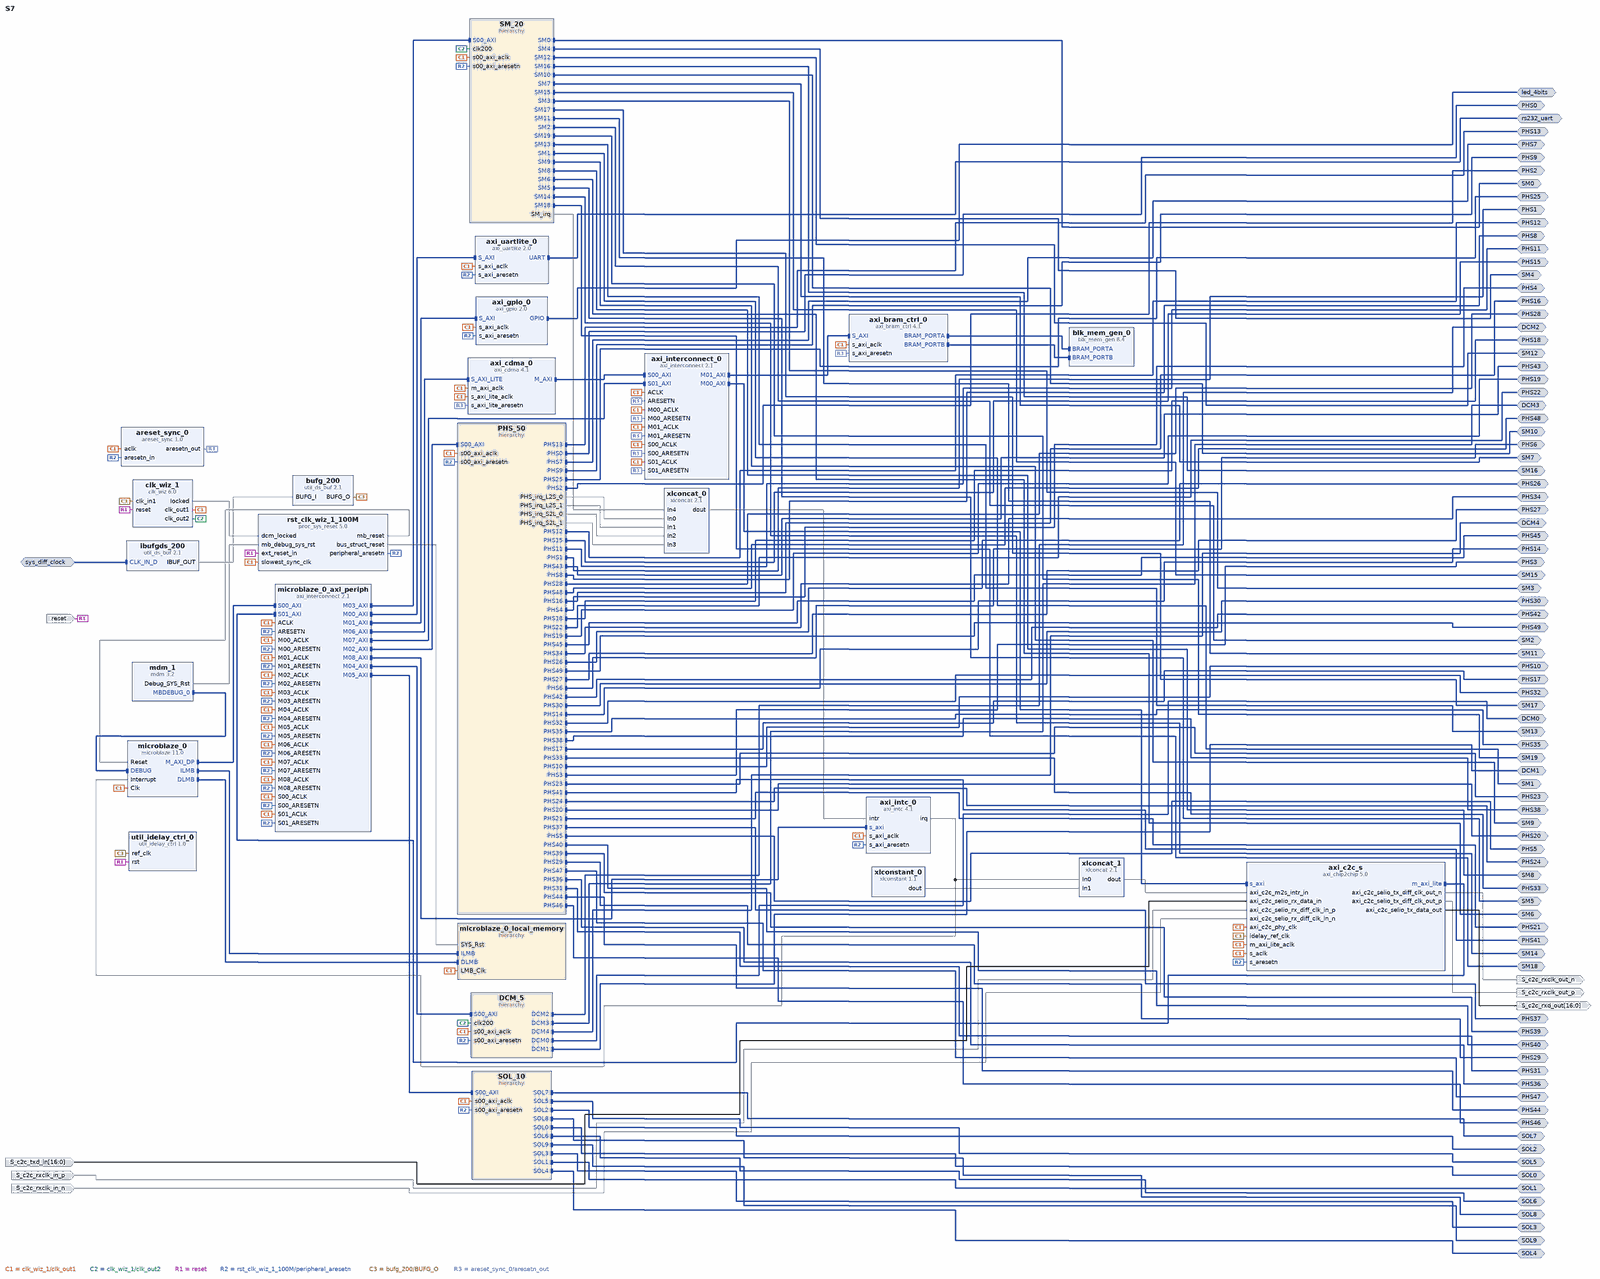
[diagram p0: block diagram of the top level, whole]
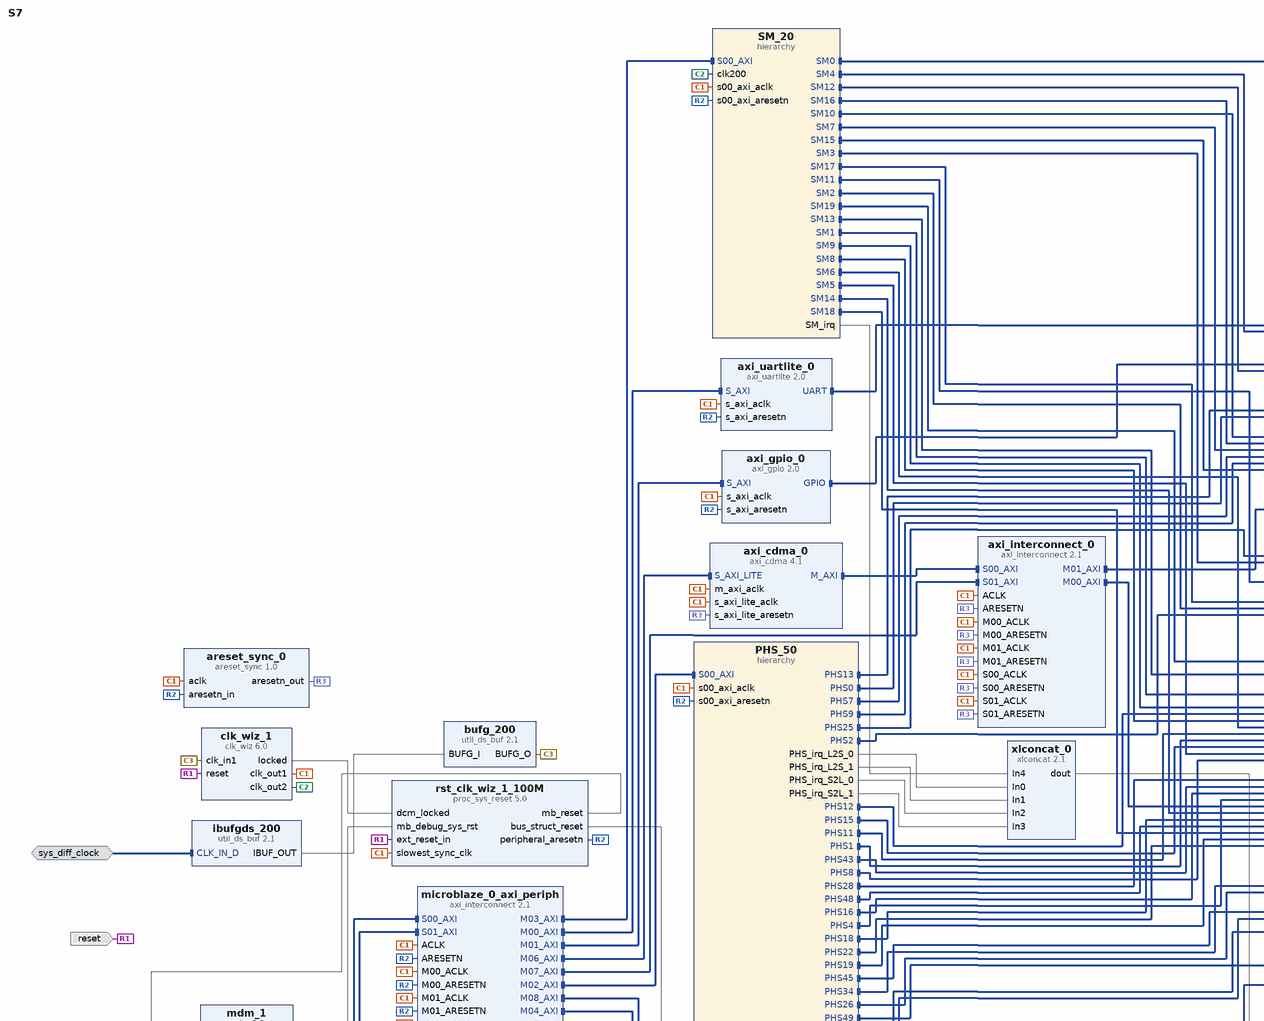
[diagram p1: block diagram of the top level, upper left part]
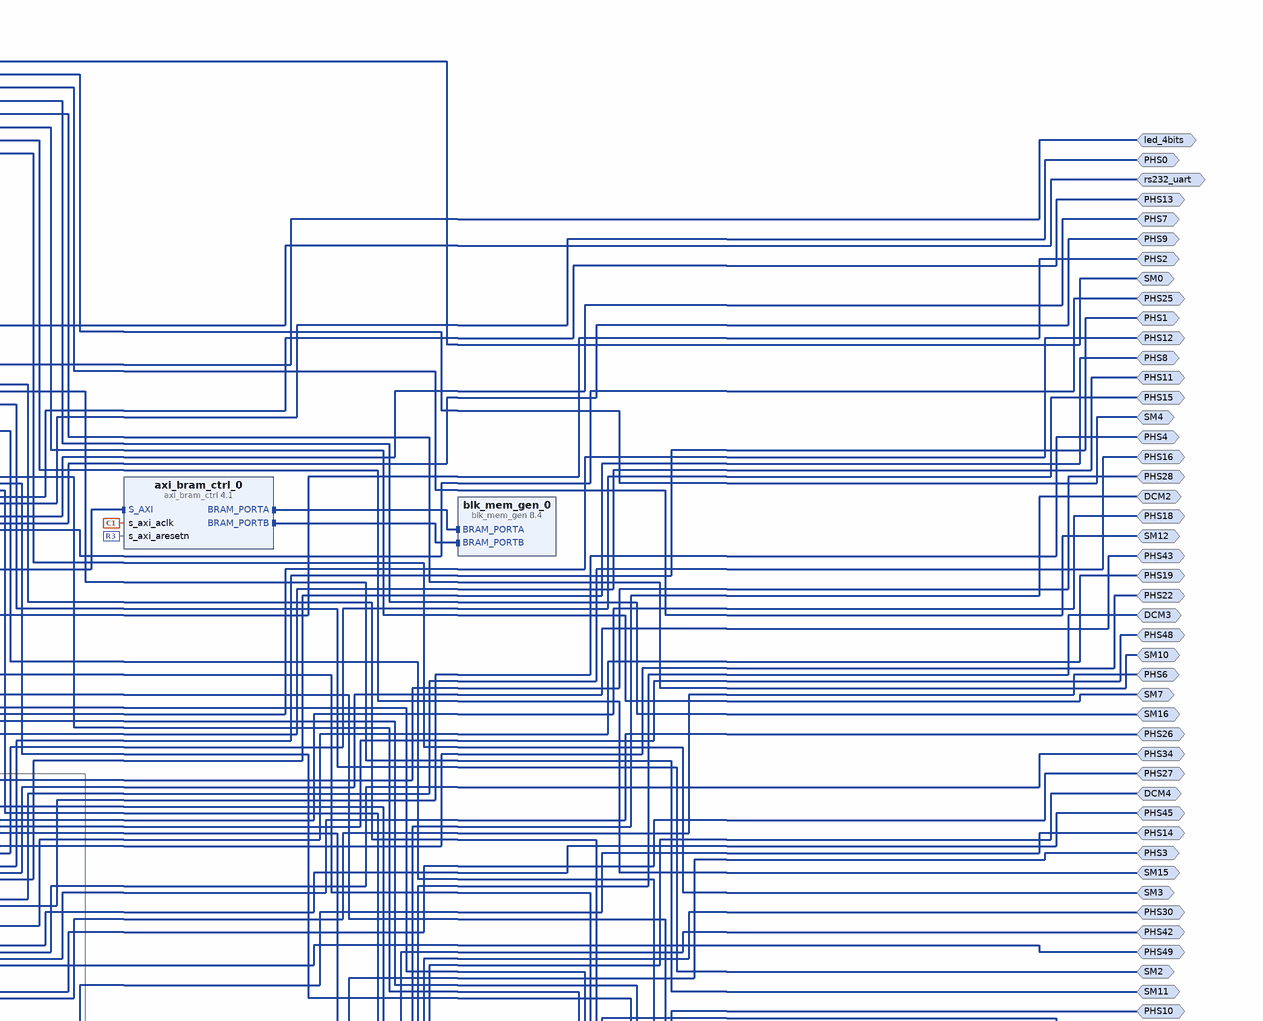
[diagram p2: block diagram of the top level, upper right part]
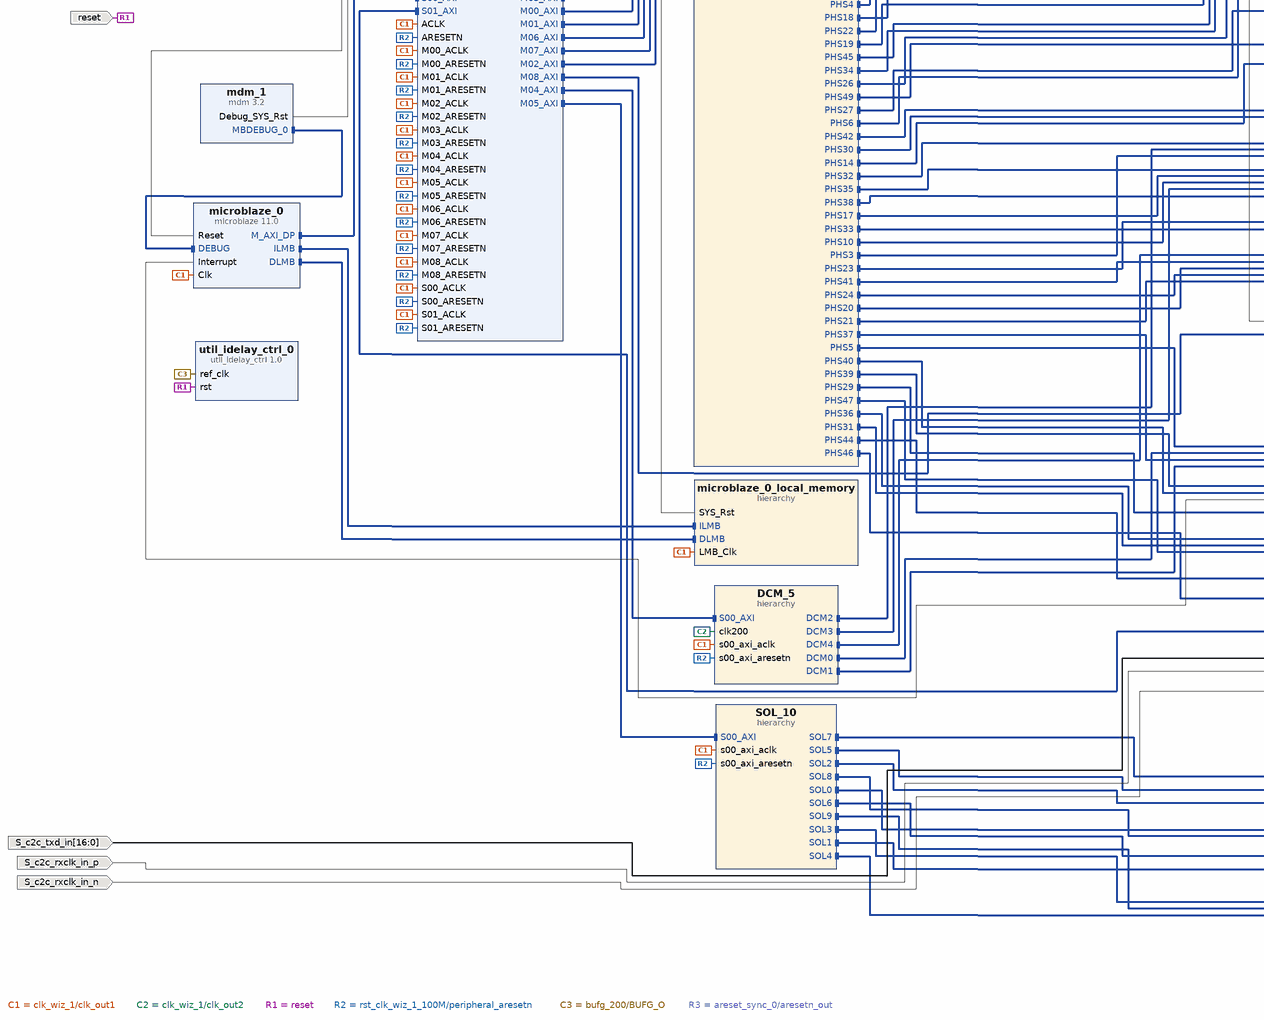
[diagram p3: block diagram of the top level, lower left part]
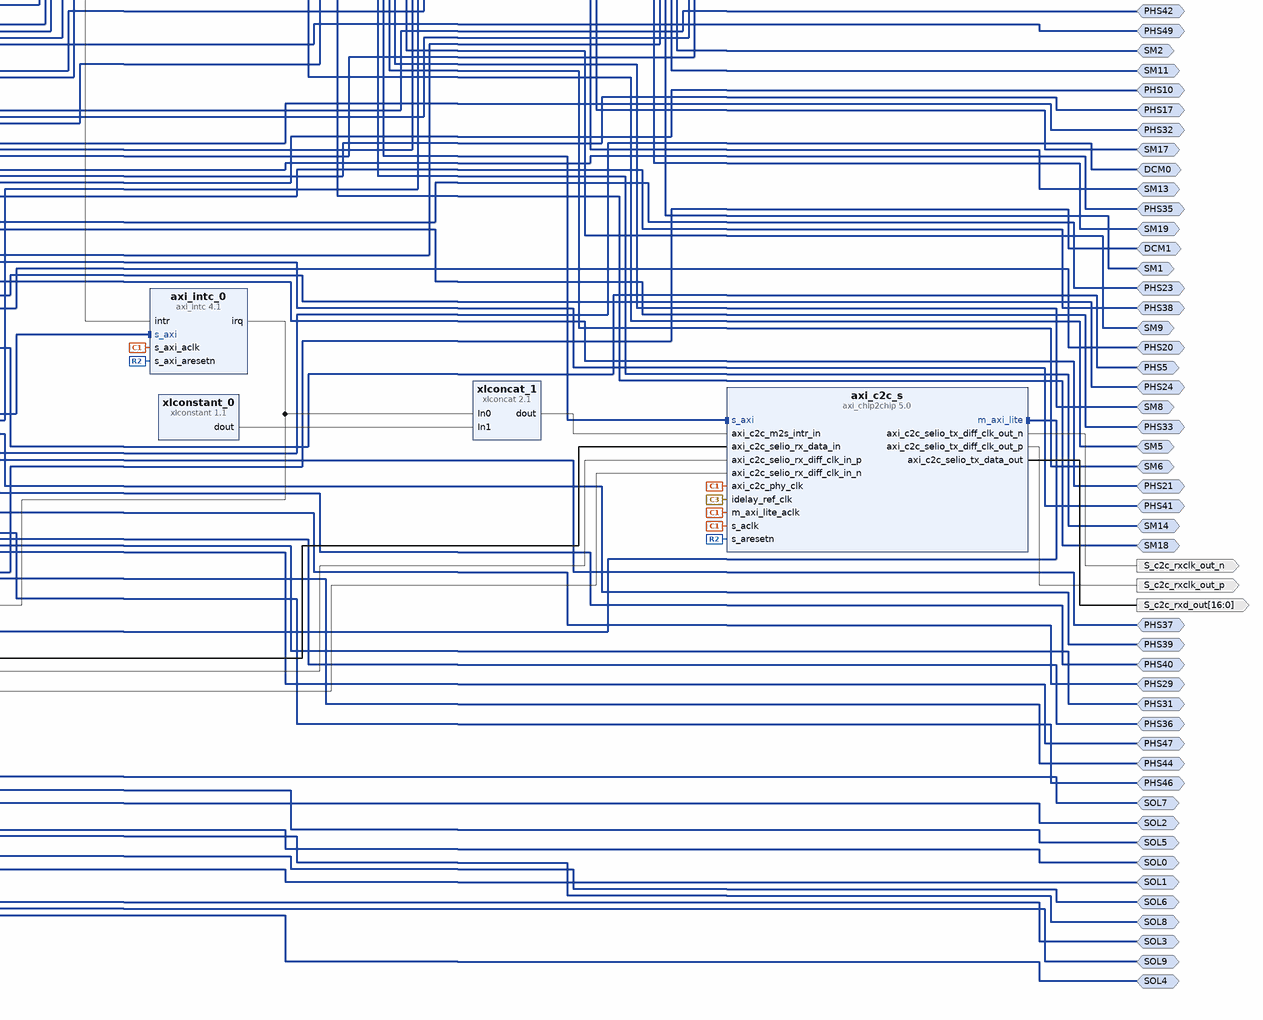
[diagram p4: block diagram of the top level, lower right part]
# Vivado block design S7, xc7s100fgga676-1, Vivado 2019.1.3
create_bd_design S7

create_bd_intf_port -mode Master -vlnv Mindway:user:DCM_IOs_rtl:1.0 DCM0
create_bd_intf_port -mode Master -vlnv Mindway:user:DCM_IOs_rtl:1.0 DCM1
create_bd_intf_port -mode Master -vlnv Mindway:user:DCM_IOs_rtl:1.0 DCM2
create_bd_intf_port -mode Master -vlnv Mindway:user:DCM_IOs_rtl:1.0 DCM3
create_bd_intf_port -mode Master -vlnv Mindway:user:DCM_IOs_rtl:1.0 DCM4
create_bd_intf_port -mode Master -vlnv Mindway:user:PHS_IOs_rtl:1.0 PHS0
create_bd_intf_port -mode Master -vlnv Mindway:user:PHS_IOs_rtl:1.0 PHS1
create_bd_intf_port -mode Master -vlnv Mindway:user:PHS_IOs_rtl:1.0 PHS2
create_bd_intf_port -mode Master -vlnv Mindway:user:PHS_IOs_rtl:1.0 PHS3
create_bd_intf_port -mode Master -vlnv Mindway:user:PHS_IOs_rtl:1.0 PHS4
create_bd_intf_port -mode Master -vlnv Mindway:user:PHS_IOs_rtl:1.0 PHS5
create_bd_intf_port -mode Master -vlnv Mindway:user:PHS_IOs_rtl:1.0 PHS6
create_bd_intf_port -mode Master -vlnv Mindway:user:PHS_IOs_rtl:1.0 PHS7
create_bd_intf_port -mode Master -vlnv Mindway:user:PHS_IOs_rtl:1.0 PHS8
create_bd_intf_port -mode Master -vlnv Mindway:user:PHS_IOs_rtl:1.0 PHS9
create_bd_intf_port -mode Master -vlnv Mindway:user:PHS_IOs_rtl:1.0 PHS10
create_bd_intf_port -mode Master -vlnv Mindway:user:PHS_IOs_rtl:1.0 PHS11
create_bd_intf_port -mode Master -vlnv Mindway:user:PHS_IOs_rtl:1.0 PHS12
create_bd_intf_port -mode Master -vlnv Mindway:user:PHS_IOs_rtl:1.0 PHS13
create_bd_intf_port -mode Master -vlnv Mindway:user:PHS_IOs_rtl:1.0 PHS14
create_bd_intf_port -mode Master -vlnv Mindway:user:PHS_IOs_rtl:1.0 PHS15
create_bd_intf_port -mode Master -vlnv Mindway:user:PHS_IOs_rtl:1.0 PHS16
create_bd_intf_port -mode Master -vlnv Mindway:user:PHS_IOs_rtl:1.0 PHS17
create_bd_intf_port -mode Master -vlnv Mindway:user:PHS_IOs_rtl:1.0 PHS18
create_bd_intf_port -mode Master -vlnv Mindway:user:PHS_IOs_rtl:1.0 PHS19
create_bd_intf_port -mode Master -vlnv Mindway:user:PHS_IOs_rtl:1.0 PHS20
create_bd_intf_port -mode Master -vlnv Mindway:user:PHS_IOs_rtl:1.0 PHS21
create_bd_intf_port -mode Master -vlnv Mindway:user:PHS_IOs_rtl:1.0 PHS22
create_bd_intf_port -mode Master -vlnv Mindway:user:PHS_IOs_rtl:1.0 PHS23
create_bd_intf_port -mode Master -vlnv Mindway:user:PHS_IOs_rtl:1.0 PHS24
create_bd_intf_port -mode Master -vlnv Mindway:user:PHS_IOs_rtl:1.0 PHS25
create_bd_intf_port -mode Master -vlnv Mindway:user:PHS_IOs_rtl:1.0 PHS26
create_bd_intf_port -mode Master -vlnv Mindway:user:PHS_IOs_rtl:1.0 PHS27
create_bd_intf_port -mode Master -vlnv Mindway:user:PHS_IOs_rtl:1.0 PHS28
create_bd_intf_port -mode Master -vlnv Mindway:user:PHS_IOs_rtl:1.0 PHS29
create_bd_intf_port -mode Master -vlnv Mindway:user:PHS_IOs_rtl:1.0 PHS30
create_bd_intf_port -mode Master -vlnv Mindway:user:PHS_IOs_rtl:1.0 PHS31
create_bd_intf_port -mode Master -vlnv Mindway:user:PHS_IOs_rtl:1.0 PHS32
create_bd_intf_port -mode Master -vlnv Mindway:user:PHS_IOs_rtl:1.0 PHS33
create_bd_intf_port -mode Master -vlnv Mindway:user:PHS_IOs_rtl:1.0 PHS34
create_bd_intf_port -mode Master -vlnv Mindway:user:PHS_IOs_rtl:1.0 PHS35
create_bd_intf_port -mode Master -vlnv Mindway:user:PHS_IOs_rtl:1.0 PHS36
create_bd_intf_port -mode Master -vlnv Mindway:user:PHS_IOs_rtl:1.0 PHS37
create_bd_intf_port -mode Master -vlnv Mindway:user:PHS_IOs_rtl:1.0 PHS38
create_bd_intf_port -mode Master -vlnv Mindway:user:PHS_IOs_rtl:1.0 PHS39
create_bd_intf_port -mode Master -vlnv Mindway:user:PHS_IOs_rtl:1.0 PHS40
create_bd_intf_port -mode Master -vlnv Mindway:user:PHS_IOs_rtl:1.0 PHS41
create_bd_intf_port -mode Master -vlnv Mindway:user:PHS_IOs_rtl:1.0 PHS42
create_bd_intf_port -mode Master -vlnv Mindway:user:PHS_IOs_rtl:1.0 PHS43
create_bd_intf_port -mode Master -vlnv Mindway:user:PHS_IOs_rtl:1.0 PHS44
create_bd_intf_port -mode Master -vlnv Mindway:user:PHS_IOs_rtl:1.0 PHS45
create_bd_intf_port -mode Master -vlnv Mindway:user:PHS_IOs_rtl:1.0 PHS46
create_bd_intf_port -mode Master -vlnv Mindway:user:PHS_IOs_rtl:1.0 PHS47
create_bd_intf_port -mode Master -vlnv Mindway:user:PHS_IOs_rtl:1.0 PHS48
create_bd_intf_port -mode Master -vlnv Mindway:user:PHS_IOs_rtl:1.0 PHS49
create_bd_intf_port -mode Master -vlnv xilinx.com:user:SM_IOs_rtl:1.0 SM0
create_bd_intf_port -mode Master -vlnv xilinx.com:user:SM_IOs_rtl:1.0 SM1
create_bd_intf_port -mode Master -vlnv xilinx.com:user:SM_IOs_rtl:1.0 SM2
create_bd_intf_port -mode Master -vlnv xilinx.com:user:SM_IOs_rtl:1.0 SM3
create_bd_intf_port -mode Master -vlnv xilinx.com:user:SM_IOs_rtl:1.0 SM4
create_bd_intf_port -mode Master -vlnv xilinx.com:user:SM_IOs_rtl:1.0 SM5
create_bd_intf_port -mode Master -vlnv xilinx.com:user:SM_IOs_rtl:1.0 SM6
create_bd_intf_port -mode Master -vlnv xilinx.com:user:SM_IOs_rtl:1.0 SM7
create_bd_intf_port -mode Master -vlnv xilinx.com:user:SM_IOs_rtl:1.0 SM8
create_bd_intf_port -mode Master -vlnv xilinx.com:user:SM_IOs_rtl:1.0 SM9
create_bd_intf_port -mode Master -vlnv xilinx.com:user:SM_IOs_rtl:1.0 SM10
create_bd_intf_port -mode Master -vlnv xilinx.com:user:SM_IOs_rtl:1.0 SM11
create_bd_intf_port -mode Master -vlnv xilinx.com:user:SM_IOs_rtl:1.0 SM12
create_bd_intf_port -mode Master -vlnv xilinx.com:user:SM_IOs_rtl:1.0 SM13
create_bd_intf_port -mode Master -vlnv xilinx.com:user:SM_IOs_rtl:1.0 SM14
create_bd_intf_port -mode Master -vlnv xilinx.com:user:SM_IOs_rtl:1.0 SM15
create_bd_intf_port -mode Master -vlnv xilinx.com:user:SM_IOs_rtl:1.0 SM16
create_bd_intf_port -mode Master -vlnv xilinx.com:user:SM_IOs_rtl:1.0 SM17
create_bd_intf_port -mode Master -vlnv xilinx.com:user:SM_IOs_rtl:1.0 SM18
create_bd_intf_port -mode Master -vlnv xilinx.com:user:SM_IOs_rtl:1.0 SM19
create_bd_intf_port -mode Master -vlnv mindway:user:SOL_IOs_rtl:1.0 SOL0
create_bd_intf_port -mode Master -vlnv mindway:user:SOL_IOs_rtl:1.0 SOL1
create_bd_intf_port -mode Master -vlnv mindway:user:SOL_IOs_rtl:1.0 SOL2
create_bd_intf_port -mode Master -vlnv mindway:user:SOL_IOs_rtl:1.0 SOL3
create_bd_intf_port -mode Master -vlnv mindway:user:SOL_IOs_rtl:1.0 SOL4
create_bd_intf_port -mode Master -vlnv mindway:user:SOL_IOs_rtl:1.0 SOL5
create_bd_intf_port -mode Master -vlnv mindway:user:SOL_IOs_rtl:1.0 SOL6
create_bd_intf_port -mode Master -vlnv mindway:user:SOL_IOs_rtl:1.0 SOL7
create_bd_intf_port -mode Master -vlnv mindway:user:SOL_IOs_rtl:1.0 SOL8
create_bd_intf_port -mode Master -vlnv mindway:user:SOL_IOs_rtl:1.0 SOL9
create_bd_intf_port -mode Master -vlnv xilinx.com:interface:gpio_rtl:1.0 led_4bits
create_bd_intf_port -mode Master -vlnv xilinx.com:interface:uart_rtl:1.0 rs232_uart
create_bd_intf_port -mode Slave -vlnv xilinx.com:interface:diff_clock_rtl:1.0 sys_diff_clock
set_property -dict {CONFIG.FREQ_HZ 200000000} [get_bd_intf_ports sys_diff_clock]
create_bd_port -dir I -type rst reset
set_property -dict {CONFIG.POLARITY ACTIVE_HIGH} [get_bd_ports reset]
create_bd_port -dir O -from 16 -to 0 S_c2c_rxd_out
create_bd_port -dir I -from 16 -to 0 S_c2c_txd_in
create_bd_port -dir I -type clk S_c2c_rxclk_in_p
set_property -dict {CONFIG.FREQ_HZ 100000000} [get_bd_ports S_c2c_rxclk_in_p]
create_bd_port -dir I -type clk S_c2c_rxclk_in_n
set_property -dict {CONFIG.FREQ_HZ 100000000} [get_bd_ports S_c2c_rxclk_in_n]
create_bd_port -dir O -type clk S_c2c_rxclk_out_p
create_bd_port -dir O -type clk S_c2c_rxclk_out_n

create_bd_cell -type hier DCM_5
create_bd_cell -type hier PHS_50
create_bd_cell -type hier SM_20
create_bd_cell -type hier microblaze_0_local_memory
create_bd_cell -type ip -vlnv xilinx.com:ip:proc_sys_reset:5.0 rst_clk_wiz_1_100M
create_bd_cell -type ip -vlnv xilinx.com:ip:util_idelay_ctrl:1.0 util_idelay_ctrl_0
create_bd_cell -type ip -vlnv xilinx.com:ip:axi_bram_ctrl:4.1 axi_bram_ctrl_0
create_bd_cell -type ip -vlnv xilinx.com:ip:axi_cdma:4.1 axi_cdma_0
set_property -dict {CONFIG.C_INCLUDE_SF 1 CONFIG.C_INCLUDE_SG 0} [get_bd_cells axi_cdma_0]
create_bd_cell -type ip -vlnv xilinx.com:ip:axi_chip2chip:5.0 axi_c2c_s
set_property -dict [list \
  CONFIG.C_AXI_ID_WIDTH 12 \
  CONFIG.C_AXI_WUSER_WIDTH 0 \
  CONFIG.C_COMMON_CLK 0 \
  CONFIG.C_INCLUDE_AXILITE 2 \
  CONFIG.C_INTERFACE_MODE 1 \
  CONFIG.C_MASTER_FPGA 1 \
  CONFIG.C_M_AXI_ID_WIDTH 12 \
  CONFIG.C_M_AXI_WUSER_WIDTH 0 \
  CONFIG.C_SUPPORT_NARROWBURST true \
  CONFIG.C_USE_DIFF_CLK true \
] [get_bd_cells axi_c2c_s]
create_bd_cell -type ip -vlnv xilinx.com:ip:axi_gpio:2.0 axi_gpio_0
set_property -dict [list \
  CONFIG.C_ALL_OUTPUTS 1 \
  CONFIG.C_GPIO_WIDTH 4 \
  CONFIG.GPIO_BOARD_INTERFACE Custom \
  CONFIG.USE_BOARD_FLOW true \
] [get_bd_cells axi_gpio_0]
create_bd_cell -type ip -vlnv xilinx.com:ip:axi_interconnect:2.1 axi_interconnect_0
set_property -dict {CONFIG.NUM_MI 2 CONFIG.NUM_SI 2} [get_bd_cells axi_interconnect_0]
create_bd_cell -type ip -vlnv xilinx.com:ip:axi_uartlite:2.0 axi_uartlite_0
set_property -dict [list \
  CONFIG.C_BAUDRATE 115200 \
  CONFIG.UARTLITE_BOARD_INTERFACE Custom \
  CONFIG.USE_BOARD_FLOW true \
] [get_bd_cells axi_uartlite_0]
create_bd_cell -type ip -vlnv xilinx.com:ip:blk_mem_gen:8.4 blk_mem_gen_0
set_property -dict [list \
  CONFIG.Assume_Synchronous_Clk true \
  CONFIG.Enable_B Use_ENB_Pin \
  CONFIG.Memory_Type True_Dual_Port_RAM \
  CONFIG.Port_B_Clock 100 \
  CONFIG.Port_B_Enable_Rate 100 \
  CONFIG.Port_B_Write_Rate 50 \
  CONFIG.Use_RSTB_Pin true \
] [get_bd_cells blk_mem_gen_0]
create_bd_cell -type ip -vlnv xilinx.com:ip:clk_wiz:6.0 clk_wiz_1
set_property -dict [list \
  CONFIG.CLKIN1_JITTER_PS 50.0 \
  CONFIG.CLKOUT1_JITTER 112.316 \
  CONFIG.CLKOUT1_PHASE_ERROR 89.971 \
  CONFIG.CLKOUT2_JITTER 98.146 \
  CONFIG.CLKOUT2_PHASE_ERROR 89.971 \
  CONFIG.CLKOUT2_REQUESTED_OUT_FREQ 200.000 \
  CONFIG.CLKOUT2_USED true \
  CONFIG.MMCM_CLKFBOUT_MULT_F 5.000 \
  CONFIG.MMCM_CLKIN1_PERIOD 5.000 \
  CONFIG.MMCM_CLKIN2_PERIOD 10.0 \
  CONFIG.MMCM_CLKOUT1_DIVIDE 5 \
  CONFIG.MMCM_DIVCLK_DIVIDE 1 \
  CONFIG.NUM_OUT_CLKS 2 \
  CONFIG.PRIM_IN_FREQ 200.000 \
  CONFIG.PRIM_SOURCE No_buffer \
] [get_bd_cells clk_wiz_1]
create_bd_cell -type ip -vlnv xilinx.com:ip:mdm:3.2 mdm_1
create_bd_cell -type ip -vlnv xilinx.com:ip:microblaze:11.0 microblaze_0
set_property -dict {CONFIG.C_DEBUG_ENABLED 1 CONFIG.C_D_AXI 1 CONFIG.C_D_LMB 1 CONFIG.C_I_LMB 1} [get_bd_cells microblaze_0]
create_bd_cell -type ip -vlnv xilinx.com:ip:axi_interconnect:2.1 microblaze_0_axi_periph
set_property -dict {CONFIG.NUM_MI 9 CONFIG.NUM_SI 2} [get_bd_cells microblaze_0_axi_periph]
create_bd_cell -type ip -vlnv xilinx.com:ip:util_ds_buf:2.1 ibufgds_200
create_bd_cell -type ip -vlnv xilinx.com:ip:util_ds_buf:2.1 bufg_200
set_property -dict {CONFIG.C_BUF_TYPE BUFG} [get_bd_cells bufg_200]
create_bd_cell -type ip -vlnv xilinx.com:ip:xlconcat:2.1 xlconcat_0
set_property -dict {CONFIG.NUM_PORTS 5} [get_bd_cells xlconcat_0]
create_bd_cell -type hier SOL_10
create_bd_cell -type ip -vlnv xilinx.com:ip:axi_intc:4.1 axi_intc_0
create_bd_cell -type ip -vlnv xilinx.com:ip:xlconcat:2.1 xlconcat_1
set_property -dict {CONFIG.IN0_WIDTH 1 CONFIG.IN1_WIDTH 3 CONFIG.NUM_PORTS 2} [get_bd_cells xlconcat_1]
create_bd_cell -type ip -vlnv xilinx.com:ip:xlconstant:1.1 xlconstant_0
set_property -dict {CONFIG.CONST_VAL 0 CONFIG.CONST_WIDTH 3} [get_bd_cells xlconstant_0]
create_bd_cell -type ip -vlnv xilinx.com:user:areset_sync:1.0 areset_sync_0

# ---- hierarchy /DCM_5 ----
current_bd_instance /DCM_5
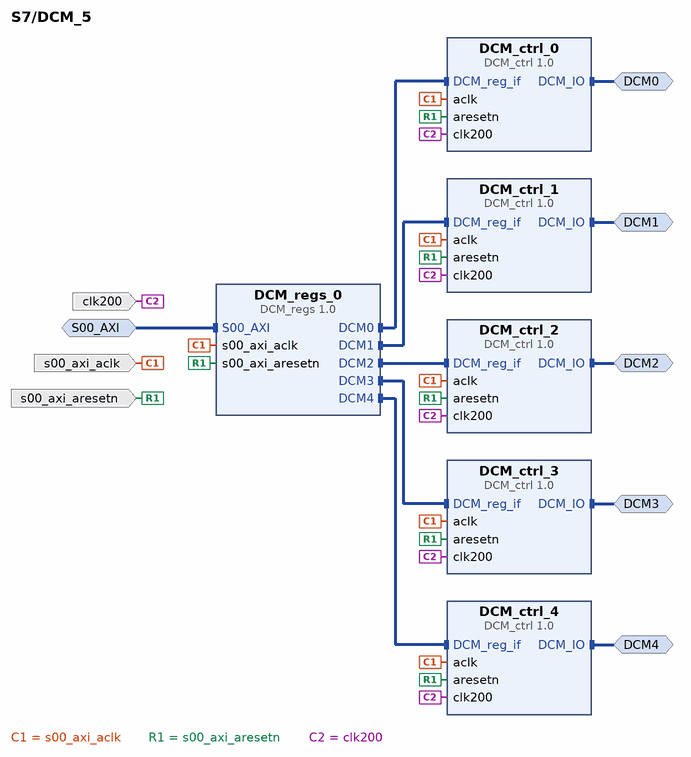
[diagram p5: block diagram inside /DCM_5]
create_bd_intf_pin -mode Master -vlnv Mindway:user:DCM_IOs_rtl:1.0 DCM0
create_bd_intf_pin -mode Master -vlnv Mindway:user:DCM_IOs_rtl:1.0 DCM1
create_bd_intf_pin -mode Master -vlnv Mindway:user:DCM_IOs_rtl:1.0 DCM2
create_bd_intf_pin -mode Master -vlnv Mindway:user:DCM_IOs_rtl:1.0 DCM3
create_bd_intf_pin -mode Master -vlnv Mindway:user:DCM_IOs_rtl:1.0 DCM4
create_bd_intf_pin -mode Slave -vlnv xilinx.com:interface:aximm_rtl:1.0 S00_AXI
create_bd_pin -dir I -type clk s00_axi_aclk
create_bd_pin -dir I -type rst s00_axi_aresetn
create_bd_pin -dir I clk200

create_bd_cell -type ip -vlnv xilinx.com:user:DCM_ctrl:1.0 DCM_ctrl_0
create_bd_cell -type ip -vlnv xilinx.com:user:DCM_ctrl:1.0 DCM_ctrl_1
create_bd_cell -type ip -vlnv xilinx.com:user:DCM_ctrl:1.0 DCM_ctrl_2
create_bd_cell -type ip -vlnv xilinx.com:user:DCM_ctrl:1.0 DCM_ctrl_3
create_bd_cell -type ip -vlnv xilinx.com:user:DCM_ctrl:1.0 DCM_ctrl_4
create_bd_cell -type ip -vlnv xilinx.com:user:DCM_regs:1.0 DCM_regs_0

# ---- hierarchy /PHS_50 ----
current_bd_instance /PHS_50
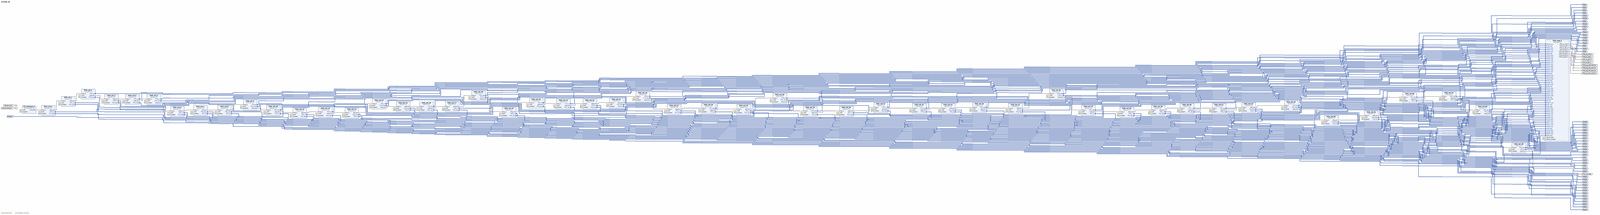
[diagram p6: block diagram inside /PHS_50, whole]
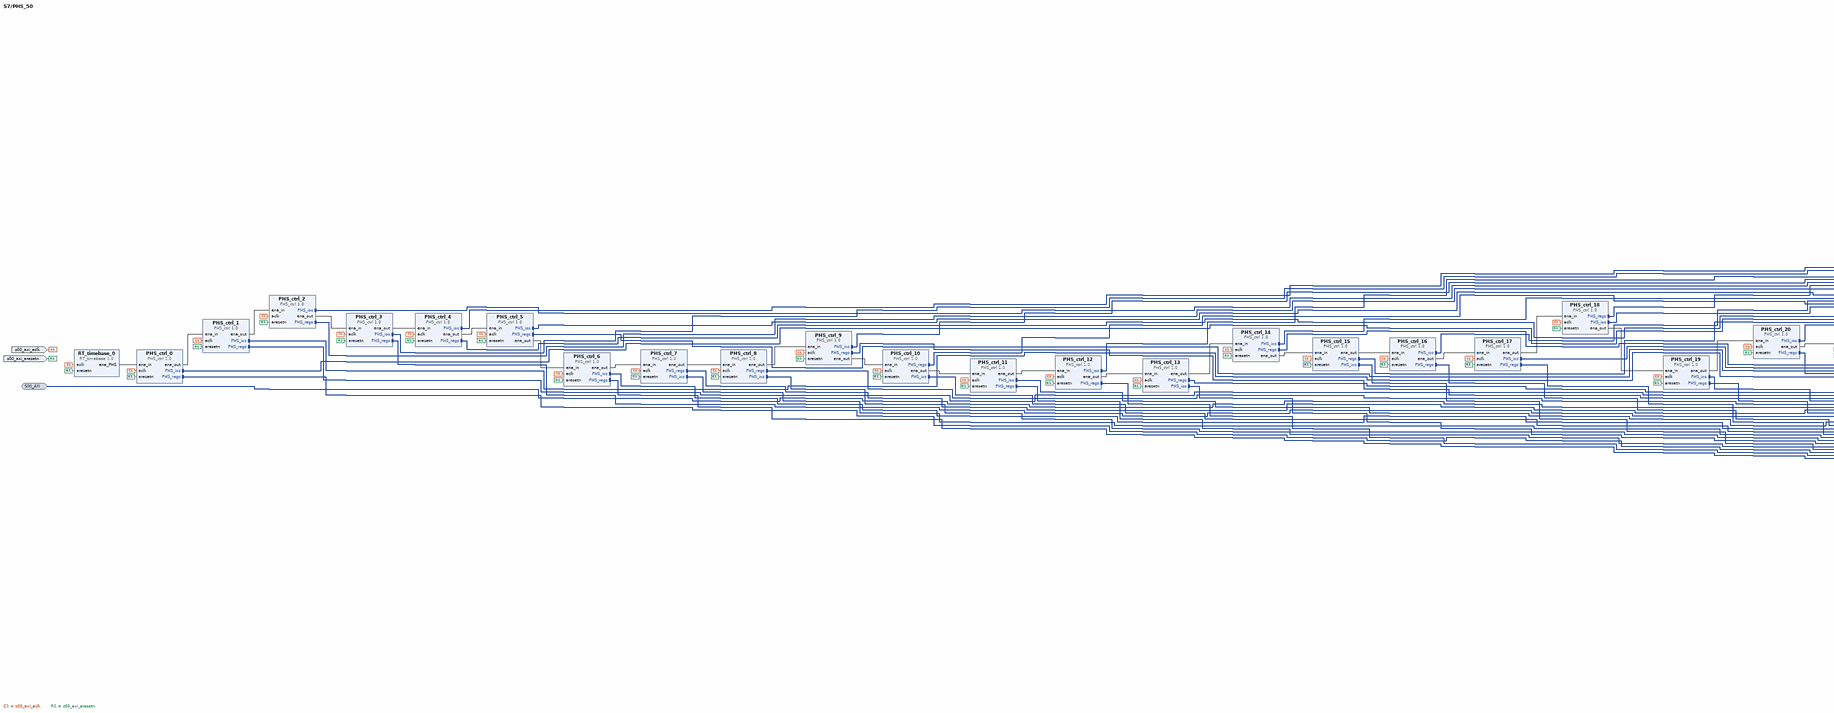
[diagram p7: block diagram inside /PHS_50, left part]
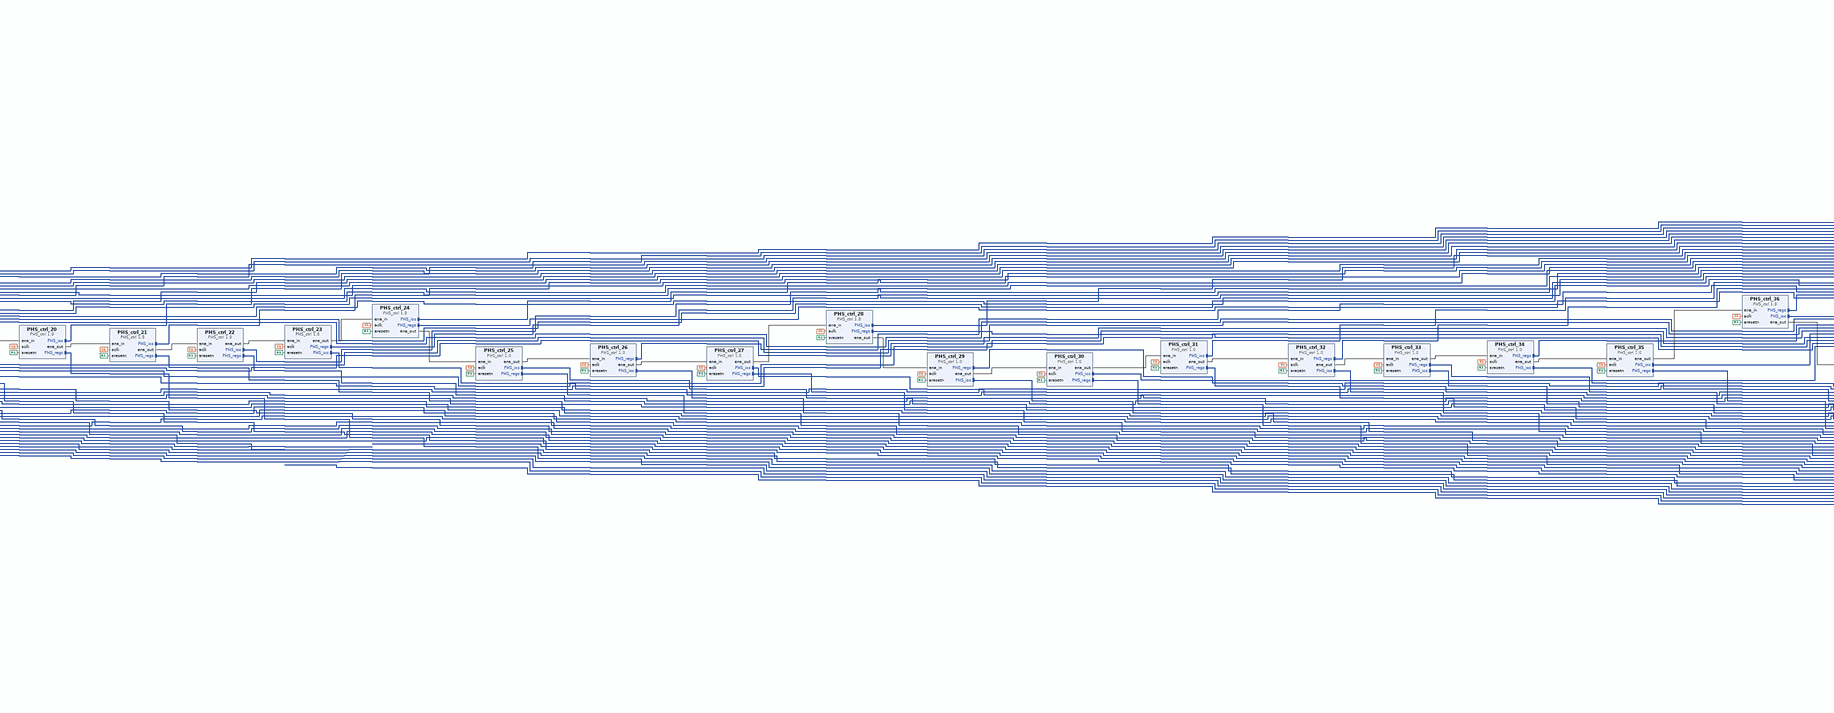
[diagram p8: block diagram inside /PHS_50, centre part]
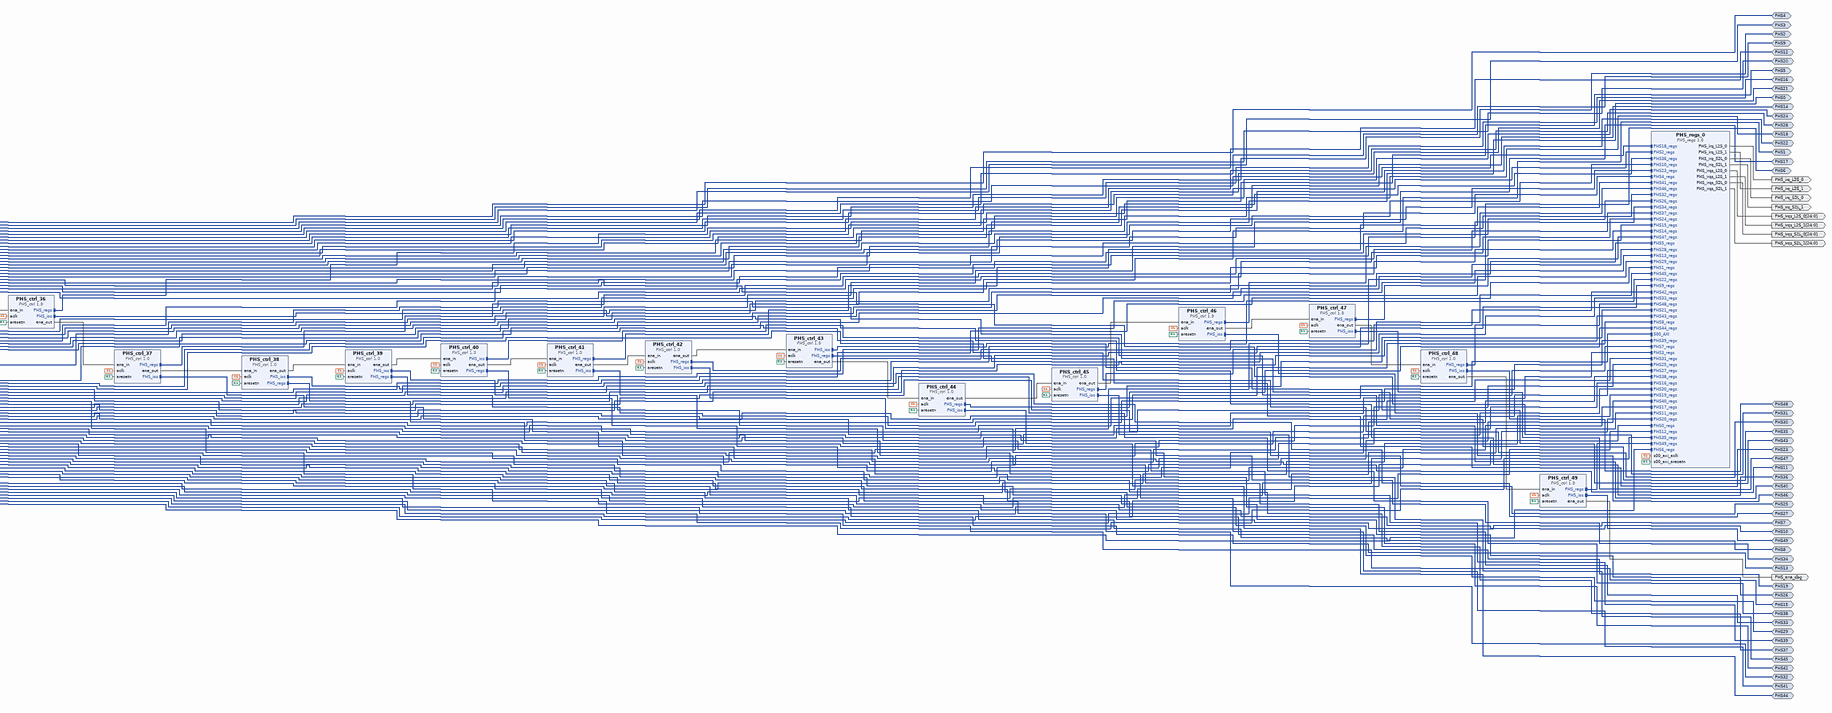
[diagram p9: block diagram inside /PHS_50, right part]
create_bd_intf_pin -mode Master -vlnv Mindway:user:PHS_IOs_rtl:1.0 PHS0
create_bd_intf_pin -mode Master -vlnv Mindway:user:PHS_IOs_rtl:1.0 PHS1
create_bd_intf_pin -mode Master -vlnv Mindway:user:PHS_IOs_rtl:1.0 PHS2
create_bd_intf_pin -mode Master -vlnv Mindway:user:PHS_IOs_rtl:1.0 PHS3
create_bd_intf_pin -mode Master -vlnv Mindway:user:PHS_IOs_rtl:1.0 PHS4
create_bd_intf_pin -mode Master -vlnv Mindway:user:PHS_IOs_rtl:1.0 PHS5
create_bd_intf_pin -mode Master -vlnv Mindway:user:PHS_IOs_rtl:1.0 PHS6
create_bd_intf_pin -mode Master -vlnv Mindway:user:PHS_IOs_rtl:1.0 PHS7
create_bd_intf_pin -mode Master -vlnv Mindway:user:PHS_IOs_rtl:1.0 PHS8
create_bd_intf_pin -mode Master -vlnv Mindway:user:PHS_IOs_rtl:1.0 PHS9
create_bd_intf_pin -mode Master -vlnv Mindway:user:PHS_IOs_rtl:1.0 PHS10
create_bd_intf_pin -mode Master -vlnv Mindway:user:PHS_IOs_rtl:1.0 PHS11
create_bd_intf_pin -mode Master -vlnv Mindway:user:PHS_IOs_rtl:1.0 PHS12
create_bd_intf_pin -mode Master -vlnv Mindway:user:PHS_IOs_rtl:1.0 PHS13
create_bd_intf_pin -mode Master -vlnv Mindway:user:PHS_IOs_rtl:1.0 PHS14
create_bd_intf_pin -mode Master -vlnv Mindway:user:PHS_IOs_rtl:1.0 PHS15
create_bd_intf_pin -mode Master -vlnv Mindway:user:PHS_IOs_rtl:1.0 PHS16
create_bd_intf_pin -mode Master -vlnv Mindway:user:PHS_IOs_rtl:1.0 PHS17
create_bd_intf_pin -mode Master -vlnv Mindway:user:PHS_IOs_rtl:1.0 PHS18
create_bd_intf_pin -mode Master -vlnv Mindway:user:PHS_IOs_rtl:1.0 PHS19
create_bd_intf_pin -mode Master -vlnv Mindway:user:PHS_IOs_rtl:1.0 PHS20
create_bd_intf_pin -mode Master -vlnv Mindway:user:PHS_IOs_rtl:1.0 PHS21
create_bd_intf_pin -mode Master -vlnv Mindway:user:PHS_IOs_rtl:1.0 PHS22
create_bd_intf_pin -mode Master -vlnv Mindway:user:PHS_IOs_rtl:1.0 PHS23
create_bd_intf_pin -mode Master -vlnv Mindway:user:PHS_IOs_rtl:1.0 PHS24
create_bd_intf_pin -mode Master -vlnv Mindway:user:PHS_IOs_rtl:1.0 PHS25
create_bd_intf_pin -mode Master -vlnv Mindway:user:PHS_IOs_rtl:1.0 PHS26
create_bd_intf_pin -mode Master -vlnv Mindway:user:PHS_IOs_rtl:1.0 PHS27
create_bd_intf_pin -mode Master -vlnv Mindway:user:PHS_IOs_rtl:1.0 PHS28
create_bd_intf_pin -mode Master -vlnv Mindway:user:PHS_IOs_rtl:1.0 PHS29
create_bd_intf_pin -mode Master -vlnv Mindway:user:PHS_IOs_rtl:1.0 PHS30
create_bd_intf_pin -mode Master -vlnv Mindway:user:PHS_IOs_rtl:1.0 PHS31
create_bd_intf_pin -mode Master -vlnv Mindway:user:PHS_IOs_rtl:1.0 PHS32
create_bd_intf_pin -mode Master -vlnv Mindway:user:PHS_IOs_rtl:1.0 PHS33
create_bd_intf_pin -mode Master -vlnv Mindway:user:PHS_IOs_rtl:1.0 PHS34
create_bd_intf_pin -mode Master -vlnv Mindway:user:PHS_IOs_rtl:1.0 PHS35
create_bd_intf_pin -mode Master -vlnv Mindway:user:PHS_IOs_rtl:1.0 PHS36
create_bd_intf_pin -mode Master -vlnv Mindway:user:PHS_IOs_rtl:1.0 PHS37
create_bd_intf_pin -mode Master -vlnv Mindway:user:PHS_IOs_rtl:1.0 PHS38
create_bd_intf_pin -mode Master -vlnv Mindway:user:PHS_IOs_rtl:1.0 PHS39
create_bd_intf_pin -mode Master -vlnv Mindway:user:PHS_IOs_rtl:1.0 PHS40
create_bd_intf_pin -mode Master -vlnv Mindway:user:PHS_IOs_rtl:1.0 PHS41
create_bd_intf_pin -mode Master -vlnv Mindway:user:PHS_IOs_rtl:1.0 PHS42
create_bd_intf_pin -mode Master -vlnv Mindway:user:PHS_IOs_rtl:1.0 PHS43
create_bd_intf_pin -mode Master -vlnv Mindway:user:PHS_IOs_rtl:1.0 PHS44
create_bd_intf_pin -mode Master -vlnv Mindway:user:PHS_IOs_rtl:1.0 PHS45
create_bd_intf_pin -mode Master -vlnv Mindway:user:PHS_IOs_rtl:1.0 PHS46
create_bd_intf_pin -mode Master -vlnv Mindway:user:PHS_IOs_rtl:1.0 PHS47
create_bd_intf_pin -mode Master -vlnv Mindway:user:PHS_IOs_rtl:1.0 PHS48
create_bd_intf_pin -mode Master -vlnv Mindway:user:PHS_IOs_rtl:1.0 PHS49
create_bd_intf_pin -mode Slave -vlnv xilinx.com:interface:aximm_rtl:1.0 S00_AXI
create_bd_pin -dir O PHS_ena_dbg
create_bd_pin -dir O PHS_irq_L2S_0
create_bd_pin -dir O PHS_irq_L2S_1
create_bd_pin -dir O PHS_irq_S2L_0
create_bd_pin -dir O PHS_irq_S2L_1
create_bd_pin -dir O -from 24 -to 0 PHS_irqs_L2S_0
create_bd_pin -dir O -from 24 -to 0 PHS_irqs_L2S_1
create_bd_pin -dir O -from 24 -to 0 PHS_irqs_S2L_0
create_bd_pin -dir O -from 24 -to 0 PHS_irqs_S2L_1
create_bd_pin -dir I -type clk s00_axi_aclk
create_bd_pin -dir I -type rst s00_axi_aresetn

create_bd_cell -type ip -vlnv xilinx.com:user:RT_timebase:1.0 RT_timebase_0
create_bd_cell -type ip -vlnv xilinx.com:user:PHS_ctrl:1.0 PHS_ctrl_0
create_bd_cell -type ip -vlnv xilinx.com:user:PHS_ctrl:1.0 PHS_ctrl_10
create_bd_cell -type ip -vlnv xilinx.com:user:PHS_ctrl:1.0 PHS_ctrl_11
create_bd_cell -type ip -vlnv xilinx.com:user:PHS_ctrl:1.0 PHS_ctrl_12
create_bd_cell -type ip -vlnv xilinx.com:user:PHS_ctrl:1.0 PHS_ctrl_13
create_bd_cell -type ip -vlnv xilinx.com:user:PHS_ctrl:1.0 PHS_ctrl_14
create_bd_cell -type ip -vlnv xilinx.com:user:PHS_ctrl:1.0 PHS_ctrl_15
create_bd_cell -type ip -vlnv xilinx.com:user:PHS_ctrl:1.0 PHS_ctrl_16
create_bd_cell -type ip -vlnv xilinx.com:user:PHS_ctrl:1.0 PHS_ctrl_17
create_bd_cell -type ip -vlnv xilinx.com:user:PHS_ctrl:1.0 PHS_ctrl_18
create_bd_cell -type ip -vlnv xilinx.com:user:PHS_ctrl:1.0 PHS_ctrl_19
create_bd_cell -type ip -vlnv xilinx.com:user:PHS_ctrl:1.0 PHS_ctrl_1
create_bd_cell -type ip -vlnv xilinx.com:user:PHS_ctrl:1.0 PHS_ctrl_20
create_bd_cell -type ip -vlnv xilinx.com:user:PHS_ctrl:1.0 PHS_ctrl_21
create_bd_cell -type ip -vlnv xilinx.com:user:PHS_ctrl:1.0 PHS_ctrl_22
create_bd_cell -type ip -vlnv xilinx.com:user:PHS_ctrl:1.0 PHS_ctrl_23
create_bd_cell -type ip -vlnv xilinx.com:user:PHS_ctrl:1.0 PHS_ctrl_24
create_bd_cell -type ip -vlnv xilinx.com:user:PHS_ctrl:1.0 PHS_ctrl_25
create_bd_cell -type ip -vlnv xilinx.com:user:PHS_ctrl:1.0 PHS_ctrl_26
create_bd_cell -type ip -vlnv xilinx.com:user:PHS_ctrl:1.0 PHS_ctrl_27
create_bd_cell -type ip -vlnv xilinx.com:user:PHS_ctrl:1.0 PHS_ctrl_28
create_bd_cell -type ip -vlnv xilinx.com:user:PHS_ctrl:1.0 PHS_ctrl_29
create_bd_cell -type ip -vlnv xilinx.com:user:PHS_ctrl:1.0 PHS_ctrl_2
create_bd_cell -type ip -vlnv xilinx.com:user:PHS_ctrl:1.0 PHS_ctrl_30
create_bd_cell -type ip -vlnv xilinx.com:user:PHS_ctrl:1.0 PHS_ctrl_31
create_bd_cell -type ip -vlnv xilinx.com:user:PHS_ctrl:1.0 PHS_ctrl_32
create_bd_cell -type ip -vlnv xilinx.com:user:PHS_ctrl:1.0 PHS_ctrl_33
create_bd_cell -type ip -vlnv xilinx.com:user:PHS_ctrl:1.0 PHS_ctrl_34
create_bd_cell -type ip -vlnv xilinx.com:user:PHS_ctrl:1.0 PHS_ctrl_35
create_bd_cell -type ip -vlnv xilinx.com:user:PHS_ctrl:1.0 PHS_ctrl_36
create_bd_cell -type ip -vlnv xilinx.com:user:PHS_ctrl:1.0 PHS_ctrl_37
create_bd_cell -type ip -vlnv xilinx.com:user:PHS_ctrl:1.0 PHS_ctrl_38
create_bd_cell -type ip -vlnv xilinx.com:user:PHS_ctrl:1.0 PHS_ctrl_39
create_bd_cell -type ip -vlnv xilinx.com:user:PHS_ctrl:1.0 PHS_ctrl_3
create_bd_cell -type ip -vlnv xilinx.com:user:PHS_ctrl:1.0 PHS_ctrl_40
create_bd_cell -type ip -vlnv xilinx.com:user:PHS_ctrl:1.0 PHS_ctrl_41
create_bd_cell -type ip -vlnv xilinx.com:user:PHS_ctrl:1.0 PHS_ctrl_42
create_bd_cell -type ip -vlnv xilinx.com:user:PHS_ctrl:1.0 PHS_ctrl_43
create_bd_cell -type ip -vlnv xilinx.com:user:PHS_ctrl:1.0 PHS_ctrl_44
create_bd_cell -type ip -vlnv xilinx.com:user:PHS_ctrl:1.0 PHS_ctrl_45
create_bd_cell -type ip -vlnv xilinx.com:user:PHS_ctrl:1.0 PHS_ctrl_46
create_bd_cell -type ip -vlnv xilinx.com:user:PHS_ctrl:1.0 PHS_ctrl_47
create_bd_cell -type ip -vlnv xilinx.com:user:PHS_ctrl:1.0 PHS_ctrl_48
create_bd_cell -type ip -vlnv xilinx.com:user:PHS_ctrl:1.0 PHS_ctrl_49
create_bd_cell -type ip -vlnv xilinx.com:user:PHS_ctrl:1.0 PHS_ctrl_4
create_bd_cell -type ip -vlnv xilinx.com:user:PHS_ctrl:1.0 PHS_ctrl_5
create_bd_cell -type ip -vlnv xilinx.com:user:PHS_ctrl:1.0 PHS_ctrl_6
create_bd_cell -type ip -vlnv xilinx.com:user:PHS_ctrl:1.0 PHS_ctrl_7
create_bd_cell -type ip -vlnv xilinx.com:user:PHS_ctrl:1.0 PHS_ctrl_8
create_bd_cell -type ip -vlnv xilinx.com:user:PHS_ctrl:1.0 PHS_ctrl_9
create_bd_cell -type ip -vlnv xilinx.com:user:PHS_regs:1.0 PHS_regs_0

# ---- hierarchy /SM_20 ----
current_bd_instance /SM_20
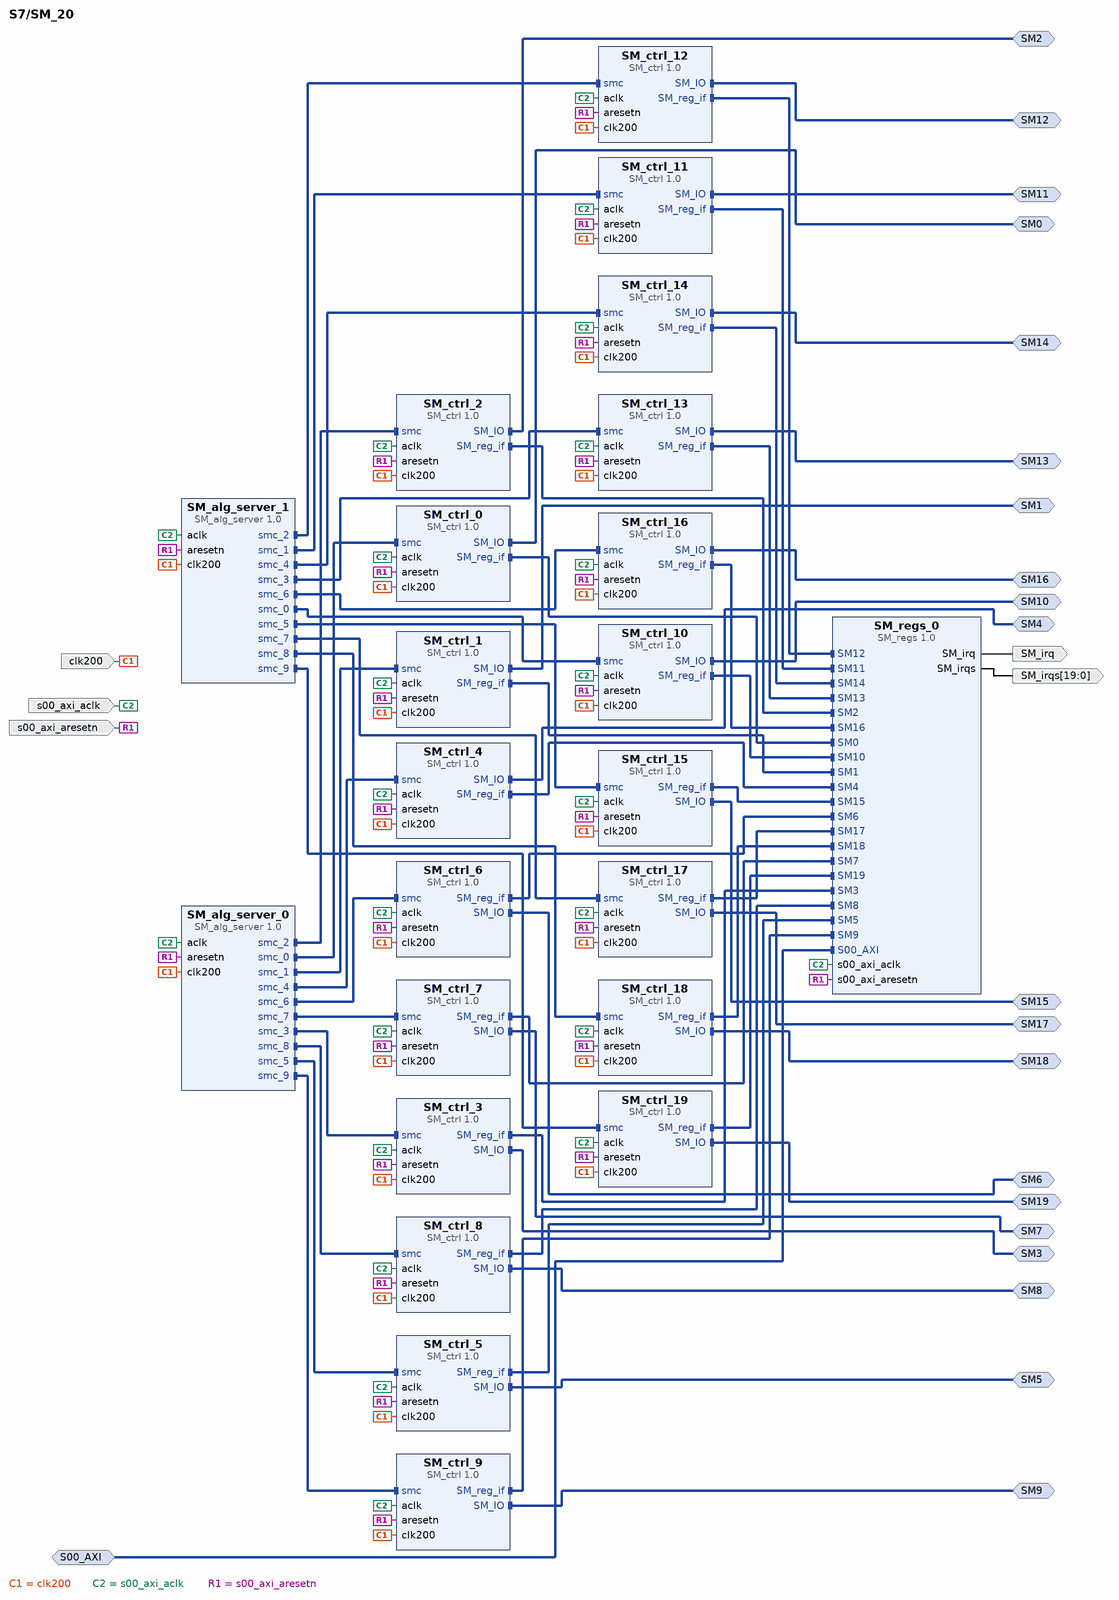
[diagram p10: block diagram inside /SM_20]
create_bd_intf_pin -mode Slave -vlnv xilinx.com:interface:aximm_rtl:1.0 S00_AXI
create_bd_intf_pin -mode Master -vlnv xilinx.com:user:SM_IOs_rtl:1.0 SM0
create_bd_intf_pin -mode Master -vlnv xilinx.com:user:SM_IOs_rtl:1.0 SM1
create_bd_intf_pin -mode Master -vlnv xilinx.com:user:SM_IOs_rtl:1.0 SM2
create_bd_intf_pin -mode Master -vlnv xilinx.com:user:SM_IOs_rtl:1.0 SM3
create_bd_intf_pin -mode Master -vlnv xilinx.com:user:SM_IOs_rtl:1.0 SM4
create_bd_intf_pin -mode Master -vlnv xilinx.com:user:SM_IOs_rtl:1.0 SM5
create_bd_intf_pin -mode Master -vlnv xilinx.com:user:SM_IOs_rtl:1.0 SM6
create_bd_intf_pin -mode Master -vlnv xilinx.com:user:SM_IOs_rtl:1.0 SM7
create_bd_intf_pin -mode Master -vlnv xilinx.com:user:SM_IOs_rtl:1.0 SM8
create_bd_intf_pin -mode Master -vlnv xilinx.com:user:SM_IOs_rtl:1.0 SM9
create_bd_intf_pin -mode Master -vlnv xilinx.com:user:SM_IOs_rtl:1.0 SM10
create_bd_intf_pin -mode Master -vlnv xilinx.com:user:SM_IOs_rtl:1.0 SM11
create_bd_intf_pin -mode Master -vlnv xilinx.com:user:SM_IOs_rtl:1.0 SM12
create_bd_intf_pin -mode Master -vlnv xilinx.com:user:SM_IOs_rtl:1.0 SM13
create_bd_intf_pin -mode Master -vlnv xilinx.com:user:SM_IOs_rtl:1.0 SM14
create_bd_intf_pin -mode Master -vlnv xilinx.com:user:SM_IOs_rtl:1.0 SM15
create_bd_intf_pin -mode Master -vlnv xilinx.com:user:SM_IOs_rtl:1.0 SM16
create_bd_intf_pin -mode Master -vlnv xilinx.com:user:SM_IOs_rtl:1.0 SM17
create_bd_intf_pin -mode Master -vlnv xilinx.com:user:SM_IOs_rtl:1.0 SM18
create_bd_intf_pin -mode Master -vlnv xilinx.com:user:SM_IOs_rtl:1.0 SM19
create_bd_pin -dir O -type intr SM_irq
create_bd_pin -dir O -from 19 -to 0 SM_irqs
create_bd_pin -dir I -type clk clk200
create_bd_pin -dir I -type clk s00_axi_aclk
create_bd_pin -dir I -type rst s00_axi_aresetn

create_bd_cell -type ip -vlnv xilinx.com:user:SM_regs:1.0 SM_regs_0
create_bd_cell -type ip -vlnv xilinx.com:user:SM_ctrl:1.0 SM_ctrl_0
set_property -dict {CONFIG.PRESENT 1} [get_bd_cells SM_ctrl_0]
create_bd_cell -type ip -vlnv xilinx.com:user:SM_ctrl:1.0 SM_ctrl_10
set_property -dict {CONFIG.PRESENT 1} [get_bd_cells SM_ctrl_10]
create_bd_cell -type ip -vlnv xilinx.com:user:SM_ctrl:1.0 SM_ctrl_11
set_property -dict {CONFIG.PRESENT 1} [get_bd_cells SM_ctrl_11]
create_bd_cell -type ip -vlnv xilinx.com:user:SM_ctrl:1.0 SM_ctrl_12
set_property -dict {CONFIG.PRESENT 1} [get_bd_cells SM_ctrl_12]
create_bd_cell -type ip -vlnv xilinx.com:user:SM_ctrl:1.0 SM_ctrl_13
set_property -dict {CONFIG.PRESENT 1} [get_bd_cells SM_ctrl_13]
create_bd_cell -type ip -vlnv xilinx.com:user:SM_ctrl:1.0 SM_ctrl_14
set_property -dict {CONFIG.PRESENT 1} [get_bd_cells SM_ctrl_14]
create_bd_cell -type ip -vlnv xilinx.com:user:SM_ctrl:1.0 SM_ctrl_15
set_property -dict {CONFIG.PRESENT 1} [get_bd_cells SM_ctrl_15]
create_bd_cell -type ip -vlnv xilinx.com:user:SM_ctrl:1.0 SM_ctrl_16
set_property -dict {CONFIG.PRESENT 1} [get_bd_cells SM_ctrl_16]
create_bd_cell -type ip -vlnv xilinx.com:user:SM_ctrl:1.0 SM_ctrl_17
set_property -dict {CONFIG.PRESENT 1} [get_bd_cells SM_ctrl_17]
create_bd_cell -type ip -vlnv xilinx.com:user:SM_ctrl:1.0 SM_ctrl_18
set_property -dict {CONFIG.PRESENT 1} [get_bd_cells SM_ctrl_18]
create_bd_cell -type ip -vlnv xilinx.com:user:SM_ctrl:1.0 SM_ctrl_19
set_property -dict {CONFIG.PRESENT 1} [get_bd_cells SM_ctrl_19]
create_bd_cell -type ip -vlnv xilinx.com:user:SM_ctrl:1.0 SM_ctrl_1
set_property -dict {CONFIG.PRESENT 0} [get_bd_cells SM_ctrl_1]
create_bd_cell -type ip -vlnv xilinx.com:user:SM_ctrl:1.0 SM_ctrl_2
set_property -dict {CONFIG.PRESENT 1} [get_bd_cells SM_ctrl_2]
create_bd_cell -type ip -vlnv xilinx.com:user:SM_ctrl:1.0 SM_ctrl_3
set_property -dict {CONFIG.PRESENT 1} [get_bd_cells SM_ctrl_3]
create_bd_cell -type ip -vlnv xilinx.com:user:SM_ctrl:1.0 SM_ctrl_4
set_property -dict {CONFIG.PRESENT 1} [get_bd_cells SM_ctrl_4]
create_bd_cell -type ip -vlnv xilinx.com:user:SM_ctrl:1.0 SM_ctrl_5
set_property -dict {CONFIG.PRESENT 1} [get_bd_cells SM_ctrl_5]
create_bd_cell -type ip -vlnv xilinx.com:user:SM_ctrl:1.0 SM_ctrl_6
set_property -dict {CONFIG.PRESENT 1} [get_bd_cells SM_ctrl_6]
create_bd_cell -type ip -vlnv xilinx.com:user:SM_ctrl:1.0 SM_ctrl_7
set_property -dict {CONFIG.PRESENT 1} [get_bd_cells SM_ctrl_7]
create_bd_cell -type ip -vlnv xilinx.com:user:SM_ctrl:1.0 SM_ctrl_8
set_property -dict {CONFIG.PRESENT 1} [get_bd_cells SM_ctrl_8]
create_bd_cell -type ip -vlnv xilinx.com:user:SM_ctrl:1.0 SM_ctrl_9
set_property -dict {CONFIG.PRESENT 1} [get_bd_cells SM_ctrl_9]
create_bd_cell -type ip -vlnv xilinx.com:user:SM_alg_server:1.0 SM_alg_server_0
create_bd_cell -type ip -vlnv xilinx.com:user:SM_alg_server:1.0 SM_alg_server_1

# ---- hierarchy /microblaze_0_local_memory ----
current_bd_instance /microblaze_0_local_memory
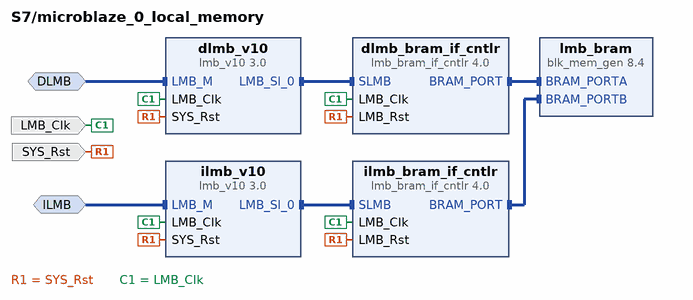
[diagram p11: block diagram inside /microblaze_0_local_memory]
create_bd_intf_pin -mode MirroredMaster -vlnv xilinx.com:interface:lmb_rtl:1.0 DLMB
create_bd_intf_pin -mode MirroredMaster -vlnv xilinx.com:interface:lmb_rtl:1.0 ILMB
create_bd_pin -dir I -type clk LMB_Clk
create_bd_pin -dir I -type rst SYS_Rst

create_bd_cell -type ip -vlnv xilinx.com:ip:lmb_v10:3.0 dlmb_v10
create_bd_cell -type ip -vlnv xilinx.com:ip:lmb_v10:3.0 ilmb_v10
create_bd_cell -type ip -vlnv xilinx.com:ip:lmb_bram_if_cntlr:4.0 dlmb_bram_if_cntlr
set_property -dict {CONFIG.C_ECC 0} [get_bd_cells dlmb_bram_if_cntlr]
create_bd_cell -type ip -vlnv xilinx.com:ip:lmb_bram_if_cntlr:4.0 ilmb_bram_if_cntlr
set_property -dict {CONFIG.C_ECC 0} [get_bd_cells ilmb_bram_if_cntlr]
create_bd_cell -type ip -vlnv xilinx.com:ip:blk_mem_gen:8.4 lmb_bram
set_property -dict [list \
  CONFIG.Enable_B Use_ENB_Pin \
  CONFIG.Memory_Type True_Dual_Port_RAM \
  CONFIG.Port_B_Clock 100 \
  CONFIG.Port_B_Enable_Rate 100 \
  CONFIG.Port_B_Write_Rate 50 \
  CONFIG.Use_RSTB_Pin true \
  CONFIG.use_bram_block BRAM_Controller \
] [get_bd_cells lmb_bram]

# ---- hierarchy /SOL_10 ----
current_bd_instance /SOL_10
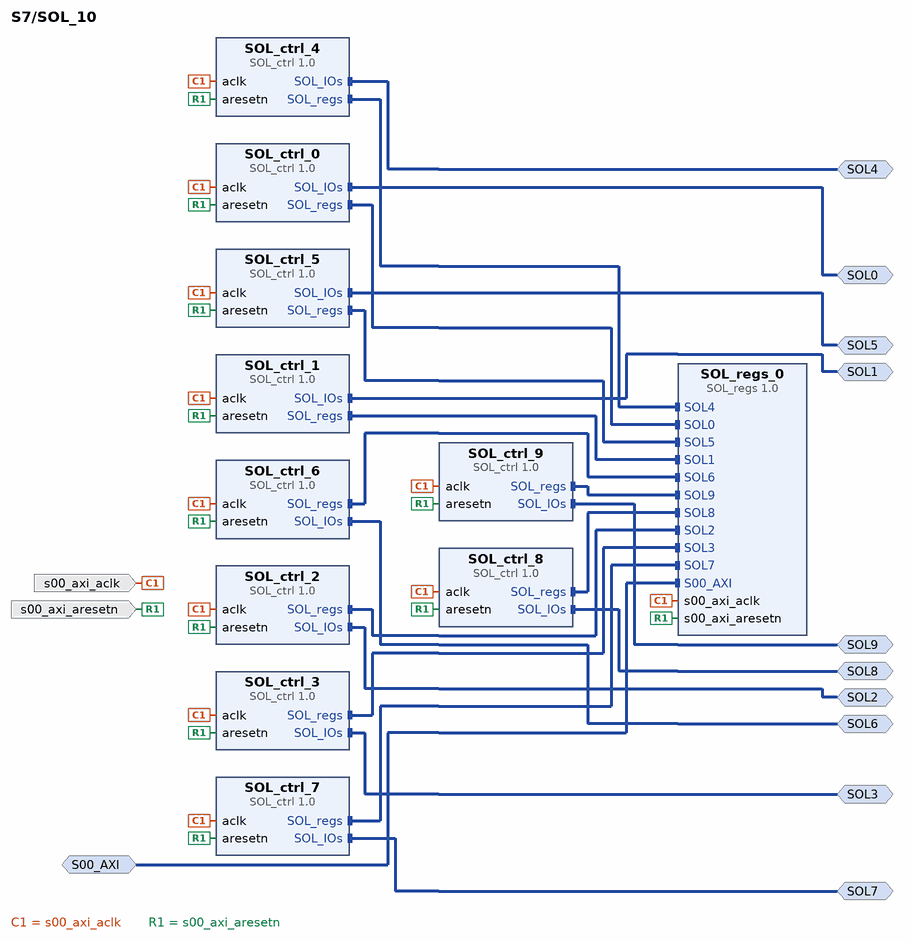
[diagram p12: block diagram inside /SOL_10]
create_bd_intf_pin -mode Slave -vlnv xilinx.com:interface:aximm_rtl:1.0 S00_AXI
create_bd_intf_pin -mode Master -vlnv mindway:user:SOL_IOs_rtl:1.0 SOL0
create_bd_intf_pin -mode Master -vlnv mindway:user:SOL_IOs_rtl:1.0 SOL1
create_bd_intf_pin -mode Master -vlnv mindway:user:SOL_IOs_rtl:1.0 SOL2
create_bd_intf_pin -mode Master -vlnv mindway:user:SOL_IOs_rtl:1.0 SOL3
create_bd_intf_pin -mode Master -vlnv mindway:user:SOL_IOs_rtl:1.0 SOL4
create_bd_intf_pin -mode Master -vlnv mindway:user:SOL_IOs_rtl:1.0 SOL5
create_bd_intf_pin -mode Master -vlnv mindway:user:SOL_IOs_rtl:1.0 SOL6
create_bd_intf_pin -mode Master -vlnv mindway:user:SOL_IOs_rtl:1.0 SOL7
create_bd_intf_pin -mode Master -vlnv mindway:user:SOL_IOs_rtl:1.0 SOL8
create_bd_intf_pin -mode Master -vlnv mindway:user:SOL_IOs_rtl:1.0 SOL9
create_bd_pin -dir I -type clk s00_axi_aclk
create_bd_pin -dir I -type rst s00_axi_aresetn

create_bd_cell -type ip -vlnv xilinx.com:user:SOL_ctrl:1.0 SOL_ctrl_0
set_property -dict {CONFIG.PRESENT 1} [get_bd_cells SOL_ctrl_0]
create_bd_cell -type ip -vlnv xilinx.com:user:SOL_ctrl:1.0 SOL_ctrl_1
set_property -dict {CONFIG.PRESENT 1} [get_bd_cells SOL_ctrl_1]
create_bd_cell -type ip -vlnv xilinx.com:user:SOL_ctrl:1.0 SOL_ctrl_2
set_property -dict {CONFIG.PRESENT 1} [get_bd_cells SOL_ctrl_2]
create_bd_cell -type ip -vlnv xilinx.com:user:SOL_ctrl:1.0 SOL_ctrl_3
set_property -dict {CONFIG.PRESENT 1} [get_bd_cells SOL_ctrl_3]
create_bd_cell -type ip -vlnv xilinx.com:user:SOL_ctrl:1.0 SOL_ctrl_4
set_property -dict {CONFIG.PRESENT 1} [get_bd_cells SOL_ctrl_4]
create_bd_cell -type ip -vlnv xilinx.com:user:SOL_ctrl:1.0 SOL_ctrl_5
set_property -dict {CONFIG.PRESENT 1} [get_bd_cells SOL_ctrl_5]
create_bd_cell -type ip -vlnv xilinx.com:user:SOL_ctrl:1.0 SOL_ctrl_6
set_property -dict {CONFIG.PRESENT 1} [get_bd_cells SOL_ctrl_6]
create_bd_cell -type ip -vlnv xilinx.com:user:SOL_ctrl:1.0 SOL_ctrl_7
set_property -dict {CONFIG.PRESENT 1} [get_bd_cells SOL_ctrl_7]
create_bd_cell -type ip -vlnv xilinx.com:user:SOL_ctrl:1.0 SOL_ctrl_8
set_property -dict {CONFIG.PRESENT 1} [get_bd_cells SOL_ctrl_8]
create_bd_cell -type ip -vlnv xilinx.com:user:SOL_ctrl:1.0 SOL_ctrl_9
set_property -dict {CONFIG.PRESENT 1} [get_bd_cells SOL_ctrl_9]
create_bd_cell -type ip -vlnv xilinx.com:user:SOL_regs:1.0 SOL_regs_0

# ---- connections ----

current_bd_instance /DCM_5
connect_bd_intf_net [get_bd_intf_pins S00_AXI] [get_bd_intf_pins DCM_regs_0/S00_AXI]
connect_bd_intf_net [get_bd_intf_pins DCM_regs_0/DCM3] [get_bd_intf_pins DCM_ctrl_3/DCM_reg_if]
connect_bd_intf_net [get_bd_intf_pins DCM_regs_0/DCM2] [get_bd_intf_pins DCM_ctrl_2/DCM_reg_if]
connect_bd_intf_net [get_bd_intf_pins DCM_regs_0/DCM1] [get_bd_intf_pins DCM_ctrl_1/DCM_reg_if]
connect_bd_intf_net [get_bd_intf_pins DCM3] [get_bd_intf_pins DCM_ctrl_3/DCM_IO]
connect_bd_intf_net [get_bd_intf_pins DCM_regs_0/DCM0] [get_bd_intf_pins DCM_ctrl_0/DCM_reg_if]
connect_bd_intf_net [get_bd_intf_pins DCM1] [get_bd_intf_pins DCM_ctrl_1/DCM_IO]
connect_bd_intf_net [get_bd_intf_pins DCM_regs_0/DCM4] [get_bd_intf_pins DCM_ctrl_4/DCM_reg_if]
connect_bd_intf_net [get_bd_intf_pins DCM0] [get_bd_intf_pins DCM_ctrl_0/DCM_IO]
connect_bd_intf_net [get_bd_intf_pins DCM4] [get_bd_intf_pins DCM_ctrl_4/DCM_IO]
connect_bd_intf_net [get_bd_intf_pins DCM2] [get_bd_intf_pins DCM_ctrl_2/DCM_IO]
connect_bd_net -net s00_axi_aclk_2_1 [get_bd_pins s00_axi_aclk] \
  [get_bd_pins DCM_ctrl_0/aclk] [get_bd_pins DCM_ctrl_1/aclk] [get_bd_pins DCM_ctrl_2/aclk] [get_bd_pins DCM_ctrl_3/aclk] \
  [get_bd_pins DCM_ctrl_4/aclk] [get_bd_pins DCM_regs_0/s00_axi_aclk]
connect_bd_net -net s00_axi_aresetn_2_1 [get_bd_pins s00_axi_aresetn] \
  [get_bd_pins DCM_ctrl_0/aresetn] [get_bd_pins DCM_ctrl_1/aresetn] [get_bd_pins DCM_ctrl_2/aresetn] \
  [get_bd_pins DCM_ctrl_3/aresetn] [get_bd_pins DCM_ctrl_4/aresetn] [get_bd_pins DCM_regs_0/s00_axi_aresetn]
connect_bd_net -net clk200_1 [get_bd_pins clk200] \
  [get_bd_pins DCM_ctrl_0/clk200] [get_bd_pins DCM_ctrl_1/clk200] [get_bd_pins DCM_ctrl_2/clk200] \
  [get_bd_pins DCM_ctrl_3/clk200] [get_bd_pins DCM_ctrl_4/clk200]

current_bd_instance /PHS_50
connect_bd_intf_net [get_bd_intf_pins PHS4] [get_bd_intf_pins PHS_ctrl_4/PHS_ios]
connect_bd_intf_net [get_bd_intf_pins PHS20] [get_bd_intf_pins PHS_ctrl_20/PHS_ios]
connect_bd_intf_net [get_bd_intf_pins PHS3] [get_bd_intf_pins PHS_ctrl_3/PHS_ios]
connect_bd_intf_net [get_bd_intf_pins PHS_ctrl_18/PHS_regs] [get_bd_intf_pins PHS_regs_0/PHS18_regs]
connect_bd_intf_net [get_bd_intf_pins PHS12] [get_bd_intf_pins PHS_ctrl_12/PHS_ios]
connect_bd_intf_net [get_bd_intf_pins PHS_ctrl_46/PHS_regs] [get_bd_intf_pins PHS_regs_0/PHS46_regs]
connect_bd_intf_net [get_bd_intf_pins PHS9] [get_bd_intf_pins PHS_ctrl_9/PHS_ios]
connect_bd_intf_net [get_bd_intf_pins PHS2] [get_bd_intf_pins PHS_ctrl_2/PHS_ios]
connect_bd_intf_net [get_bd_intf_pins PHS16] [get_bd_intf_pins PHS_ctrl_16/PHS_ios]
connect_bd_intf_net [get_bd_intf_pins PHS_ctrl_48/PHS_regs] [get_bd_intf_pins PHS_regs_0/PHS48_regs]
connect_bd_intf_net [get_bd_intf_pins PHS_ctrl_2/PHS_regs] [get_bd_intf_pins PHS_regs_0/PHS2_regs]
connect_bd_intf_net [get_bd_intf_pins PHS_ctrl_36/PHS_regs] [get_bd_intf_pins PHS_regs_0/PHS36_regs]
connect_bd_intf_net [get_bd_intf_pins PHS28] [get_bd_intf_pins PHS_ctrl_28/PHS_ios]
connect_bd_intf_net [get_bd_intf_pins PHS21] [get_bd_intf_pins PHS_ctrl_21/PHS_ios]
connect_bd_intf_net [get_bd_intf_pins PHS24] [get_bd_intf_pins PHS_ctrl_24/PHS_ios]
connect_bd_intf_net [get_bd_intf_pins PHS5] [get_bd_intf_pins PHS_ctrl_5/PHS_ios]
connect_bd_intf_net [get_bd_intf_pins PHS48] [get_bd_intf_pins PHS_ctrl_48/PHS_ios]
connect_bd_intf_net [get_bd_intf_pins PHS14] [get_bd_intf_pins PHS_ctrl_14/PHS_ios]
connect_bd_intf_net [get_bd_intf_pins PHS22] [get_bd_intf_pins PHS_ctrl_22/PHS_ios]
connect_bd_intf_net [get_bd_intf_pins PHS47] [get_bd_intf_pins PHS_ctrl_47/PHS_ios]
connect_bd_intf_net [get_bd_intf_pins PHS_ctrl_10/PHS_regs] [get_bd_intf_pins PHS_regs_0/PHS10_regs]
connect_bd_intf_net [get_bd_intf_pins PHS43] [get_bd_intf_pins PHS_ctrl_43/PHS_ios]
connect_bd_intf_net [get_bd_intf_pins PHS_ctrl_23/PHS_regs] [get_bd_intf_pins PHS_regs_0/PHS23_regs]
connect_bd_intf_net [get_bd_intf_pins PHS18] [get_bd_intf_pins PHS_ctrl_18/PHS_ios]
connect_bd_intf_net [get_bd_intf_pins PHS_ctrl_4/PHS_regs] [get_bd_intf_pins PHS_regs_0/PHS4_regs]
connect_bd_intf_net [get_bd_intf_pins PHS31] [get_bd_intf_pins PHS_ctrl_31/PHS_ios]
connect_bd_intf_net [get_bd_intf_pins PHS0] [get_bd_intf_pins PHS_ctrl_0/PHS_ios]
connect_bd_intf_net [get_bd_intf_pins PHS_ctrl_41/PHS_regs] [get_bd_intf_pins PHS_regs_0/PHS41_regs]
connect_bd_intf_net [get_bd_intf_pins PHS_ctrl_32/PHS_regs] [get_bd_intf_pins PHS_regs_0/PHS32_regs]
connect_bd_intf_net [get_bd_intf_pins PHS46] [get_bd_intf_pins PHS_ctrl_46/PHS_ios]
connect_bd_intf_net [get_bd_intf_pins PHS40] [get_bd_intf_pins PHS_ctrl_40/PHS_ios]
connect_bd_intf_net [get_bd_intf_pins PHS_ctrl_26/PHS_regs] [get_bd_intf_pins PHS_regs_0/PHS26_regs]
connect_bd_intf_net [get_bd_intf_pins PHS_ctrl_47/PHS_regs] [get_bd_intf_pins PHS_regs_0/PHS47_regs]
connect_bd_intf_net [get_bd_intf_pins PHS35] [get_bd_intf_pins PHS_ctrl_35/PHS_ios]
connect_bd_intf_net [get_bd_intf_pins PHS_ctrl_34/PHS_regs] [get_bd_intf_pins PHS_regs_0/PHS34_regs]
connect_bd_intf_net [get_bd_intf_pins PHS_ctrl_37/PHS_regs] [get_bd_intf_pins PHS_regs_0/PHS37_regs]
connect_bd_intf_net [get_bd_intf_pins PHS_ctrl_24/PHS_regs] [get_bd_intf_pins PHS_regs_0/PHS24_regs]
connect_bd_intf_net [get_bd_intf_pins PHS_ctrl_45/PHS_regs] [get_bd_intf_pins PHS_regs_0/PHS45_regs]
connect_bd_intf_net [get_bd_intf_pins PHS_ctrl_15/PHS_regs] [get_bd_intf_pins PHS_regs_0/PHS15_regs]
connect_bd_intf_net [get_bd_intf_pins PHS36] [get_bd_intf_pins PHS_ctrl_36/PHS_ios]
connect_bd_intf_net [get_bd_intf_pins PHS_ctrl_14/PHS_regs] [get_bd_intf_pins PHS_regs_0/PHS14_regs]
connect_bd_intf_net [get_bd_intf_pins PHS17] [get_bd_intf_pins PHS_ctrl_17/PHS_ios]
connect_bd_intf_net [get_bd_intf_pins PHS_ctrl_5/PHS_regs] [get_bd_intf_pins PHS_regs_0/PHS5_regs]
connect_bd_intf_net [get_bd_intf_pins PHS1] [get_bd_intf_pins PHS_ctrl_1/PHS_ios]
connect_bd_intf_net [get_bd_intf_pins PHS30] [get_bd_intf_pins PHS_ctrl_30/PHS_ios]
connect_bd_intf_net [get_bd_intf_pins PHS_ctrl_28/PHS_regs] [get_bd_intf_pins PHS_regs_0/PHS28_regs]
connect_bd_intf_net [get_bd_intf_pins PHS_ctrl_13/PHS_regs] [get_bd_intf_pins PHS_regs_0/PHS13_regs]
connect_bd_intf_net [get_bd_intf_pins PHS23] [get_bd_intf_pins PHS_ctrl_23/PHS_ios]
connect_bd_intf_net [get_bd_intf_pins PHS_ctrl_29/PHS_regs] [get_bd_intf_pins PHS_regs_0/PHS29_regs]
connect_bd_intf_net [get_bd_intf_pins PHS_ctrl_1/PHS_regs] [get_bd_intf_pins PHS_regs_0/PHS1_regs]
connect_bd_intf_net [get_bd_intf_pins PHS_ctrl_22/PHS_regs] [get_bd_intf_pins PHS_regs_0/PHS22_regs]
connect_bd_intf_net [get_bd_intf_pins PHS27] [get_bd_intf_pins PHS_ctrl_27/PHS_ios]
connect_bd_intf_net [get_bd_intf_pins PHS38] [get_bd_intf_pins PHS_ctrl_38/PHS_ios]
connect_bd_intf_net [get_bd_intf_pins PHS_ctrl_9/PHS_regs] [get_bd_intf_pins PHS_regs_0/PHS9_regs]
connect_bd_intf_net [get_bd_intf_pins PHS_ctrl_42/PHS_regs] [get_bd_intf_pins PHS_regs_0/PHS42_regs]
connect_bd_intf_net [get_bd_intf_pins PHS25] [get_bd_intf_pins PHS_ctrl_25/PHS_ios]
connect_bd_intf_net [get_bd_intf_pins PHS_ctrl_33/PHS_regs] [get_bd_intf_pins PHS_regs_0/PHS33_regs]
connect_bd_intf_net [get_bd_intf_pins PHS34] [get_bd_intf_pins PHS_ctrl_34/PHS_ios]
connect_bd_intf_net [get_bd_intf_pins PHS39] [get_bd_intf_pins PHS_ctrl_39/PHS_ios]
connect_bd_intf_net [get_bd_intf_pins PHS_ctrl_21/PHS_regs] [get_bd_intf_pins PHS_regs_0/PHS21_regs]
connect_bd_intf_net [get_bd_intf_pins PHS_ctrl_8/PHS_regs] [get_bd_intf_pins PHS_regs_0/PHS8_regs]
connect_bd_intf_net [get_bd_intf_pins PHS_ctrl_43/PHS_regs] [get_bd_intf_pins PHS_regs_0/PHS43_regs]
connect_bd_intf_net [get_bd_intf_pins PHS_ctrl_44/PHS_regs] [get_bd_intf_pins PHS_regs_0/PHS44_regs]
connect_bd_intf_net [get_bd_intf_pins PHS33] [get_bd_intf_pins PHS_ctrl_33/PHS_ios]
connect_bd_intf_net [get_bd_intf_pins S00_AXI] [get_bd_intf_pins PHS_regs_0/S00_AXI]
connect_bd_intf_net [get_bd_intf_pins PHS_ctrl_39/PHS_regs] [get_bd_intf_pins PHS_regs_0/PHS39_regs]
connect_bd_intf_net [get_bd_intf_pins PHS_ctrl_49/PHS_regs] [get_bd_intf_pins PHS_regs_0/PHS49_regs]
connect_bd_intf_net [get_bd_intf_pins PHS42] [get_bd_intf_pins PHS_ctrl_42/PHS_ios]
connect_bd_intf_net [get_bd_intf_pins PHS_ctrl_7/PHS_regs] [get_bd_intf_pins PHS_regs_0/PHS7_regs]
connect_bd_intf_net [get_bd_intf_pins PHS_ctrl_3/PHS_regs] [get_bd_intf_pins PHS_regs_0/PHS3_regs]
connect_bd_intf_net [get_bd_intf_pins PHS_ctrl_31/PHS_regs] [get_bd_intf_pins PHS_regs_0/PHS31_regs]
connect_bd_intf_net [get_bd_intf_pins PHS11] [get_bd_intf_pins PHS_ctrl_11/PHS_ios]
connect_bd_intf_net [get_bd_intf_pins PHS37] [get_bd_intf_pins PHS_ctrl_37/PHS_ios]
connect_bd_intf_net [get_bd_intf_pins PHS_ctrl_25/PHS_regs] [get_bd_intf_pins PHS_regs_0/PHS25_regs]
connect_bd_intf_net [get_bd_intf_pins PHS_ctrl_27/PHS_regs] [get_bd_intf_pins PHS_regs_0/PHS27_regs]
connect_bd_intf_net [get_bd_intf_pins PHS41] [get_bd_intf_pins PHS_ctrl_41/PHS_ios]
connect_bd_intf_net [get_bd_intf_pins PHS29] [get_bd_intf_pins PHS_ctrl_29/PHS_ios]
connect_bd_intf_net [get_bd_intf_pins PHS45] [get_bd_intf_pins PHS_ctrl_45/PHS_ios]
connect_bd_intf_net [get_bd_intf_pins PHS26] [get_bd_intf_pins PHS_ctrl_26/PHS_ios]
connect_bd_intf_net [get_bd_intf_pins PHS6] [get_bd_intf_pins PHS_ctrl_6/PHS_ios]
connect_bd_intf_net [get_bd_intf_pins PHS_ctrl_38/PHS_regs] [get_bd_intf_pins PHS_regs_0/PHS38_regs]
connect_bd_intf_net [get_bd_intf_pins PHS19] [get_bd_intf_pins PHS_ctrl_19/PHS_ios]
connect_bd_intf_net [get_bd_intf_pins PHS_ctrl_16/PHS_regs] [get_bd_intf_pins PHS_regs_0/PHS16_regs]
connect_bd_intf_net [get_bd_intf_pins PHS32] [get_bd_intf_pins PHS_ctrl_32/PHS_ios]
connect_bd_intf_net [get_bd_intf_pins PHS10] [get_bd_intf_pins PHS_ctrl_10/PHS_ios]
connect_bd_intf_net [get_bd_intf_pins PHS7] [get_bd_intf_pins PHS_ctrl_7/PHS_ios]
connect_bd_intf_net [get_bd_intf_pins PHS49] [get_bd_intf_pins PHS_ctrl_49/PHS_ios]
connect_bd_intf_net [get_bd_intf_pins PHS8] [get_bd_intf_pins PHS_ctrl_8/PHS_ios]
connect_bd_intf_net [get_bd_intf_pins PHS13] [get_bd_intf_pins PHS_ctrl_13/PHS_ios]
connect_bd_intf_net [get_bd_intf_pins PHS_ctrl_30/PHS_regs] [get_bd_intf_pins PHS_regs_0/PHS30_regs]
connect_bd_intf_net [get_bd_intf_pins PHS_ctrl_19/PHS_regs] [get_bd_intf_pins PHS_regs_0/PHS19_regs]
connect_bd_intf_net [get_bd_intf_pins PHS_ctrl_40/PHS_regs] [get_bd_intf_pins PHS_regs_0/PHS40_regs]
connect_bd_intf_net [get_bd_intf_pins PHS_ctrl_17/PHS_regs] [get_bd_intf_pins PHS_regs_0/PHS17_regs]
connect_bd_intf_net [get_bd_intf_pins PHS_ctrl_11/PHS_regs] [get_bd_intf_pins PHS_regs_0/PHS11_regs]
connect_bd_intf_net [get_bd_intf_pins PHS15] [get_bd_intf_pins PHS_ctrl_15/PHS_ios]
connect_bd_intf_net [get_bd_intf_pins PHS44] [get_bd_intf_pins PHS_ctrl_44/PHS_ios]
connect_bd_intf_net [get_bd_intf_pins PHS_ctrl_20/PHS_regs] [get_bd_intf_pins PHS_regs_0/PHS20_regs]
connect_bd_intf_net [get_bd_intf_pins PHS_ctrl_0/PHS_regs] [get_bd_intf_pins PHS_regs_0/PHS0_regs]
connect_bd_intf_net [get_bd_intf_pins PHS_ctrl_12/PHS_regs] [get_bd_intf_pins PHS_regs_0/PHS12_regs]
connect_bd_intf_net [get_bd_intf_pins PHS_ctrl_35/PHS_regs] [get_bd_intf_pins PHS_regs_0/PHS35_regs]
connect_bd_intf_net [get_bd_intf_pins PHS_ctrl_6/PHS_regs] [get_bd_intf_pins PHS_regs_0/PHS6_regs]
connect_bd_net [get_bd_pins PHS_ctrl_0/ena_out] [get_bd_pins PHS_ctrl_1/ena_in]
connect_bd_net [get_bd_pins PHS_ctrl_10/ena_out] [get_bd_pins PHS_ctrl_11/ena_in]
connect_bd_net [get_bd_pins PHS_ctrl_11/ena_out] [get_bd_pins PHS_ctrl_12/ena_in]
connect_bd_net [get_bd_pins PHS_ctrl_12/ena_out] [get_bd_pins PHS_ctrl_13/ena_in]
connect_bd_net [get_bd_pins PHS_ctrl_13/ena_out] [get_bd_pins PHS_ctrl_14/ena_in]
connect_bd_net [get_bd_pins PHS_ctrl_14/ena_out] [get_bd_pins PHS_ctrl_15/ena_in]
connect_bd_net [get_bd_pins PHS_ctrl_15/ena_out] [get_bd_pins PHS_ctrl_16/ena_in]
connect_bd_net [get_bd_pins PHS_ctrl_16/ena_out] [get_bd_pins PHS_ctrl_17/ena_in]
connect_bd_net [get_bd_pins PHS_ctrl_17/ena_out] [get_bd_pins PHS_ctrl_18/ena_in]
connect_bd_net [get_bd_pins PHS_ctrl_18/ena_out] [get_bd_pins PHS_ctrl_19/ena_in]
connect_bd_net [get_bd_pins PHS_ctrl_19/ena_out] [get_bd_pins PHS_ctrl_20/ena_in]
connect_bd_net [get_bd_pins PHS_ctrl_1/ena_out] [get_bd_pins PHS_ctrl_2/ena_in]
connect_bd_net [get_bd_pins PHS_ctrl_20/ena_out] [get_bd_pins PHS_ctrl_21/ena_in]
connect_bd_net [get_bd_pins PHS_ctrl_21/ena_out] [get_bd_pins PHS_ctrl_22/ena_in]
connect_bd_net [get_bd_pins PHS_ctrl_22/ena_out] [get_bd_pins PHS_ctrl_23/ena_in]
connect_bd_net [get_bd_pins PHS_ctrl_23/ena_out] [get_bd_pins PHS_ctrl_24/ena_in]
connect_bd_net [get_bd_pins PHS_ctrl_24/ena_out] [get_bd_pins PHS_ctrl_25/ena_in]
connect_bd_net [get_bd_pins PHS_ctrl_25/ena_out] [get_bd_pins PHS_ctrl_26/ena_in]
connect_bd_net [get_bd_pins PHS_ctrl_26/ena_out] [get_bd_pins PHS_ctrl_27/ena_in]
connect_bd_net [get_bd_pins PHS_ctrl_27/ena_out] [get_bd_pins PHS_ctrl_28/ena_in]
connect_bd_net [get_bd_pins PHS_ctrl_28/ena_out] [get_bd_pins PHS_ctrl_29/ena_in]
connect_bd_net [get_bd_pins PHS_ctrl_29/ena_out] [get_bd_pins PHS_ctrl_30/ena_in]
connect_bd_net [get_bd_pins PHS_ctrl_2/ena_out] [get_bd_pins PHS_ctrl_3/ena_in]
connect_bd_net [get_bd_pins PHS_ctrl_30/ena_out] [get_bd_pins PHS_ctrl_31/ena_in]
connect_bd_net [get_bd_pins PHS_ctrl_31/ena_out] [get_bd_pins PHS_ctrl_32/ena_in]
connect_bd_net [get_bd_pins PHS_ctrl_32/ena_out] [get_bd_pins PHS_ctrl_33/ena_in]
connect_bd_net [get_bd_pins PHS_ctrl_33/ena_out] [get_bd_pins PHS_ctrl_34/ena_in]
connect_bd_net [get_bd_pins PHS_ctrl_34/ena_out] [get_bd_pins PHS_ctrl_35/ena_in]
connect_bd_net [get_bd_pins PHS_ctrl_35/ena_out] [get_bd_pins PHS_ctrl_36/ena_in]
connect_bd_net [get_bd_pins PHS_ctrl_36/ena_out] [get_bd_pins PHS_ctrl_37/ena_in]
connect_bd_net [get_bd_pins PHS_ctrl_37/ena_out] [get_bd_pins PHS_ctrl_38/ena_in]
connect_bd_net [get_bd_pins PHS_ctrl_38/ena_out] [get_bd_pins PHS_ctrl_39/ena_in]
connect_bd_net [get_bd_pins PHS_ctrl_39/ena_out] [get_bd_pins PHS_ctrl_40/ena_in]
connect_bd_net [get_bd_pins PHS_ctrl_3/ena_out] [get_bd_pins PHS_ctrl_4/ena_in]
connect_bd_net [get_bd_pins PHS_ctrl_40/ena_out] [get_bd_pins PHS_ctrl_41/ena_in]
connect_bd_net [get_bd_pins PHS_ctrl_41/ena_out] [get_bd_pins PHS_ctrl_42/ena_in]
connect_bd_net [get_bd_pins PHS_ctrl_42/ena_out] [get_bd_pins PHS_ctrl_43/ena_in]
connect_bd_net [get_bd_pins PHS_ctrl_43/ena_out] [get_bd_pins PHS_ctrl_44/ena_in]
connect_bd_net [get_bd_pins PHS_ctrl_44/ena_out] [get_bd_pins PHS_ctrl_45/ena_in]
connect_bd_net [get_bd_pins PHS_ctrl_45/ena_out] [get_bd_pins PHS_ctrl_46/ena_in]
connect_bd_net [get_bd_pins PHS_ctrl_46/ena_out] [get_bd_pins PHS_ctrl_47/ena_in]
connect_bd_net [get_bd_pins PHS_ctrl_47/ena_out] [get_bd_pins PHS_ctrl_48/ena_in]
connect_bd_net [get_bd_pins PHS_ctrl_48/ena_out] [get_bd_pins PHS_ctrl_49/ena_in]
connect_bd_net [get_bd_pins PHS_ctrl_49/ena_out] [get_bd_pins PHS_ena_dbg]
connect_bd_net [get_bd_pins PHS_ctrl_4/ena_out] [get_bd_pins PHS_ctrl_5/ena_in]
connect_bd_net [get_bd_pins PHS_ctrl_5/ena_out] [get_bd_pins PHS_ctrl_6/ena_in]
connect_bd_net [get_bd_pins PHS_ctrl_6/ena_out] [get_bd_pins PHS_ctrl_7/ena_in]
connect_bd_net [get_bd_pins PHS_ctrl_7/ena_out] [get_bd_pins PHS_ctrl_8/ena_in]
connect_bd_net [get_bd_pins PHS_ctrl_8/ena_out] [get_bd_pins PHS_ctrl_9/ena_in]
connect_bd_net [get_bd_pins PHS_ctrl_9/ena_out] [get_bd_pins PHS_ctrl_10/ena_in]
connect_bd_net [get_bd_pins PHS_regs_0/PHS_irq_L2S_0] [get_bd_pins PHS_irq_L2S_0]
connect_bd_net [get_bd_pins PHS_regs_0/PHS_irq_L2S_1] [get_bd_pins PHS_irq_L2S_1]
connect_bd_net [get_bd_pins PHS_regs_0/PHS_irq_S2L_0] [get_bd_pins PHS_irq_S2L_0]
connect_bd_net [get_bd_pins PHS_regs_0/PHS_irq_S2L_1] [get_bd_pins PHS_irq_S2L_1]
connect_bd_net [get_bd_pins PHS_regs_0/PHS_irqs_L2S_0] [get_bd_pins PHS_irqs_L2S_0]
connect_bd_net [get_bd_pins PHS_regs_0/PHS_irqs_L2S_1] [get_bd_pins PHS_irqs_L2S_1]
connect_bd_net [get_bd_pins PHS_regs_0/PHS_irqs_S2L_0] [get_bd_pins PHS_irqs_S2L_0]
connect_bd_net [get_bd_pins PHS_regs_0/PHS_irqs_S2L_1] [get_bd_pins PHS_irqs_S2L_1]
connect_bd_net -net s00_axi_aclk_1_1 [get_bd_pins s00_axi_aclk] \
  [get_bd_pins RT_timebase_0/aclk] [get_bd_pins PHS_ctrl_0/aclk] [get_bd_pins PHS_ctrl_10/aclk] \
  [get_bd_pins PHS_ctrl_11/aclk] [get_bd_pins PHS_ctrl_12/aclk] [get_bd_pins PHS_ctrl_13/aclk] [get_bd_pins PHS_ctrl_14/aclk] \
  [get_bd_pins PHS_ctrl_15/aclk] [get_bd_pins PHS_ctrl_16/aclk] [get_bd_pins PHS_ctrl_17/aclk] [get_bd_pins PHS_ctrl_18/aclk] \
  [get_bd_pins PHS_ctrl_19/aclk] [get_bd_pins PHS_ctrl_1/aclk] [get_bd_pins PHS_ctrl_20/aclk] [get_bd_pins PHS_ctrl_21/aclk] \
  [get_bd_pins PHS_ctrl_22/aclk] [get_bd_pins PHS_ctrl_23/aclk] [get_bd_pins PHS_ctrl_24/aclk] [get_bd_pins PHS_ctrl_25/aclk] \
  [get_bd_pins PHS_ctrl_26/aclk] [get_bd_pins PHS_ctrl_27/aclk] [get_bd_pins PHS_ctrl_28/aclk] [get_bd_pins PHS_ctrl_29/aclk] \
  [get_bd_pins PHS_ctrl_2/aclk] [get_bd_pins PHS_ctrl_30/aclk] [get_bd_pins PHS_ctrl_31/aclk] [get_bd_pins PHS_ctrl_32/aclk] \
  [get_bd_pins PHS_ctrl_33/aclk] [get_bd_pins PHS_ctrl_34/aclk] [get_bd_pins PHS_ctrl_35/aclk] [get_bd_pins PHS_ctrl_36/aclk] \
  [get_bd_pins PHS_ctrl_37/aclk] [get_bd_pins PHS_ctrl_38/aclk] [get_bd_pins PHS_ctrl_39/aclk] [get_bd_pins PHS_ctrl_3/aclk] \
  [get_bd_pins PHS_ctrl_40/aclk] [get_bd_pins PHS_ctrl_41/aclk] [get_bd_pins PHS_ctrl_42/aclk] [get_bd_pins PHS_ctrl_43/aclk] \
  [get_bd_pins PHS_ctrl_44/aclk] [get_bd_pins PHS_ctrl_45/aclk] [get_bd_pins PHS_ctrl_46/aclk] [get_bd_pins PHS_ctrl_47/aclk] \
  [get_bd_pins PHS_ctrl_48/aclk] [get_bd_pins PHS_ctrl_49/aclk] [get_bd_pins PHS_ctrl_4/aclk] [get_bd_pins PHS_ctrl_5/aclk] \
  [get_bd_pins PHS_ctrl_6/aclk] [get_bd_pins PHS_ctrl_7/aclk] [get_bd_pins PHS_ctrl_8/aclk] [get_bd_pins PHS_ctrl_9/aclk] \
  [get_bd_pins PHS_regs_0/s00_axi_aclk]
connect_bd_net -net s00_axi_aresetn_1_1 [get_bd_pins s00_axi_aresetn] \
  [get_bd_pins RT_timebase_0/aresetn] [get_bd_pins PHS_ctrl_0/aresetn] [get_bd_pins PHS_ctrl_10/aresetn] \
  [get_bd_pins PHS_ctrl_11/aresetn] [get_bd_pins PHS_ctrl_12/aresetn] [get_bd_pins PHS_ctrl_13/aresetn] \
  [get_bd_pins PHS_ctrl_14/aresetn] [get_bd_pins PHS_ctrl_15/aresetn] [get_bd_pins PHS_ctrl_16/aresetn] \
  [get_bd_pins PHS_ctrl_17/aresetn] [get_bd_pins PHS_ctrl_18/aresetn] [get_bd_pins PHS_ctrl_19/aresetn] \
  [get_bd_pins PHS_ctrl_1/aresetn] [get_bd_pins PHS_ctrl_20/aresetn] [get_bd_pins PHS_ctrl_21/aresetn] \
  [get_bd_pins PHS_ctrl_22/aresetn] [get_bd_pins PHS_ctrl_23/aresetn] [get_bd_pins PHS_ctrl_24/aresetn] \
  [get_bd_pins PHS_ctrl_25/aresetn] [get_bd_pins PHS_ctrl_26/aresetn] [get_bd_pins PHS_ctrl_27/aresetn] \
  [get_bd_pins PHS_ctrl_28/aresetn] [get_bd_pins PHS_ctrl_29/aresetn] [get_bd_pins PHS_ctrl_2/aresetn] \
  [get_bd_pins PHS_ctrl_30/aresetn] [get_bd_pins PHS_ctrl_31/aresetn] [get_bd_pins PHS_ctrl_32/aresetn] \
  [get_bd_pins PHS_ctrl_33/aresetn] [get_bd_pins PHS_ctrl_34/aresetn] [get_bd_pins PHS_ctrl_35/aresetn] \
  [get_bd_pins PHS_ctrl_36/aresetn] [get_bd_pins PHS_ctrl_37/aresetn] [get_bd_pins PHS_ctrl_38/aresetn] \
  [get_bd_pins PHS_ctrl_39/aresetn] [get_bd_pins PHS_ctrl_3/aresetn] [get_bd_pins PHS_ctrl_40/aresetn] \
  [get_bd_pins PHS_ctrl_41/aresetn] [get_bd_pins PHS_ctrl_42/aresetn] [get_bd_pins PHS_ctrl_43/aresetn] \
  [get_bd_pins PHS_ctrl_44/aresetn] [get_bd_pins PHS_ctrl_45/aresetn] [get_bd_pins PHS_ctrl_46/aresetn] \
  [get_bd_pins PHS_ctrl_47/aresetn] [get_bd_pins PHS_ctrl_48/aresetn] [get_bd_pins PHS_ctrl_49/aresetn] \
  [get_bd_pins PHS_ctrl_4/aresetn] [get_bd_pins PHS_ctrl_5/aresetn] [get_bd_pins PHS_ctrl_6/aresetn] \
  [get_bd_pins PHS_ctrl_7/aresetn] [get_bd_pins PHS_ctrl_8/aresetn] [get_bd_pins PHS_ctrl_9/aresetn] \
  [get_bd_pins PHS_regs_0/s00_axi_aresetn]
connect_bd_net [get_bd_pins RT_timebase_0/ena_PHS] [get_bd_pins PHS_ctrl_0/ena_in]
